# EAGLE design tracker (EAGLE 6.4)

## Sheet 1 of 4
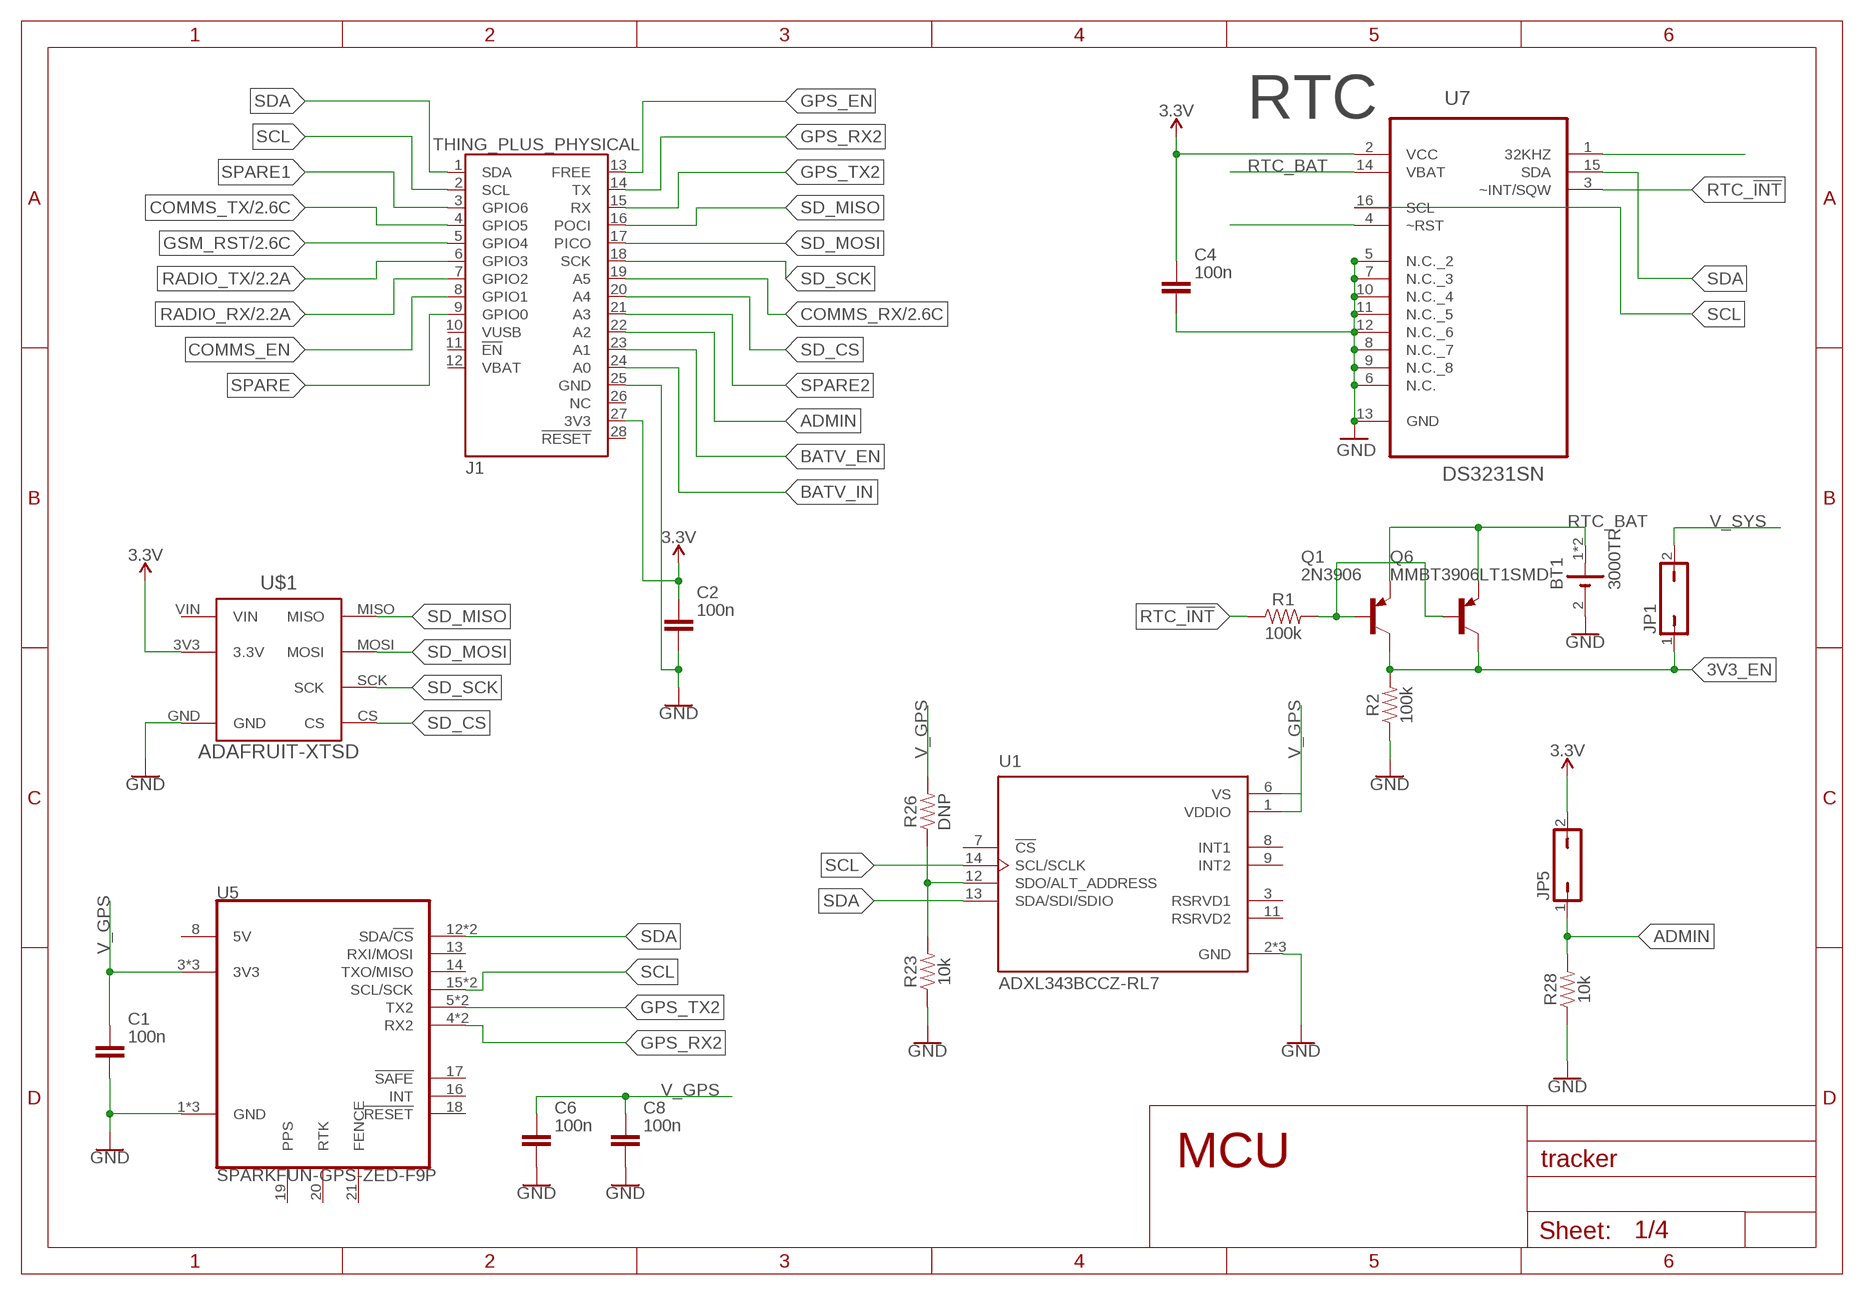
[diagram p0: schematic, sheet 1]

### Parts
BT1  3000TR  [BAT_3000TR]
C1  100n  C_CHIP-0603(1608-METRIC)  [CAPC1608X85]
C2  100n  C_CHIP-0603(1608-METRIC)  [CAPC1608X85]
C4  100n  C_CHIP-0603(1608-METRIC)  [CAPC1608X85]
C6  100n  C_CHIP-0603(1608-METRIC)  [CAPC1608X85]
C8  100n  C_CHIP-0603(1608-METRIC)  [CAPC1608X85]
J1  THING_PLUS_PHYSICAL  [THING_PLUS]
JP1  JP1Q  [JP1]
JP5  JP1Q  [JP1]
Q1  2N3906  [TO92]
Q6  MMBT3906LT1SMD  [SOT23-BEC]
R1  100k  RESISTOR0603  [0603]
R2  100k  RESISTOR0603  [0603]
R23  10k  RESISTOR0603  [0603]
R26  DNP  RESISTOR0603  [0603]
R28  10k  RESISTOR0603  [0603]
U1  ADXL343BCCZ-RL7  [PQFN80P300X500X100-14N]
U5  SPARKFUN-GPS-ZED-F9P  [SPARKFUN-GPS-ZED-F9P]
U7  DS3231SN  [SOIC127P1032X265-16N]
U$1  ADAFRUIT-XTSD  [ADAFRUIT-XTSD]

### Nets
3.3V: C2.1 C4.1 J1.27(3V3) JP5.2 U7.2(VCC) U$1.3V3(3.3V) ; also sheet 2,3,4
3V3_EN: JP1.1 Q1.1(C) Q6.C R2.2 ; also sheet 3
ADMIN: J1.22(A2) JP5.1 R28.2
BATV_EN: J1.23(A1) ; also sheet 4
BATV_IN: J1.24(A0) ; also sheet 4
COMMS_EN: J1.8(GPIO1) ; also sheet 3
COMMS_RX: J1.19(A5) ; also sheet 2
COMMS_TX: J1.4(GPIO5) ; also sheet 2
GND: BT1.2(-) C1.2 C2.2 C4.2 C6.2 C8.2 J1.25(GND) R2.1 R23.1 R28.1 U1.2(GND) U1.4(GND) U1.5(GND) U5.1(GND) U5.7(GND) U5.25(GND) U7.5(N.C._2) U7.6(N.C.) U7.7(N.C._3) U7.8(N.C._7) U7.9(N.C._8) U7.10(N.C._4) U7.11(N.C._5) U7.12(N.C._6) U7.13(GND) U$1.GND ; also sheet 2,3,4
GPS_EN: J1.13(FREE) ; also sheet 3
GPS_RX2: J1.14(TX) U5.4(RX2) U5.11(RX2)
GPS_TX2: J1.15(RX) U5.5(TX2) U5.10(TX2)
GSM_RST: J1.5(GPIO4) ; also sheet 2
N$1: R23.2 R26.1 U1.12(SDO/ALT_ADDRESS)
N$2: Q1.2(B) Q6.B R1.2
N$32: U7.1(32KHZ)
N$52: U7.4(~RST)
RADIO_RX: J1.7(GPIO2) ; also sheet 2
RADIO_TX: J1.6(GPIO3) ; also sheet 2
RTC_!INT: R1.1 U7.3(~INT/SQW)
RTC_BAT: BT1.1(+) BT1.3(+) Q1.3(E) Q6.E U7.14(VBAT)
SCL: J1.2(SCL) U1.14(SCL/SCLK) U5.15(SCL/SCK) U5.22(SCL/SCK) U7.16(SCL)
SD_CS: J1.20(A4) U$1.CS
SD_MISO: J1.16(POCI) U$1.MISO
SD_MOSI: J1.17(PICO) U$1.MOSI
SD_SCK: J1.18(SCK) U$1.SCK
SDA: J1.1(SDA) U1.13(SDA/SDI/SDIO) U5.12(SDA/!CS) U5.23(SDA/!CS) U7.15(SDA)
SPARE: J1.9(GPIO0)
SPARE1: J1.3(GPIO6)
SPARE2: J1.21(A3)
V_GPS: C1.1 C6.1 C8.1 R26.2 U1.1(VDDIO) U1.6(VS) U5.3(3V3) U5.9(3V3) U5.24(3V3) ; also sheet 2,3
V_SYS: JP1.2 ; also sheet 3,4
Unconnected: J1.10(VUSB) J1.11(!EN) J1.12(VBAT) J1.26(NC) J1.28(!RESET) U1.3(RSRVD1) U1.7(!CS) U1.8(INT1) U1.9(INT2) U1.11(RSRVD2) U5.8(5V) U5.13(RXI/MOSI) U5.14(TXO/MISO) U5.16(INT) U5.17(!SAFE) U5.18(!RESET) U5.19(PPS) U5.20(RTK) U5.21(FENCE) U$1.VIN

### Notes on the sheet
- RTC
- MCU

## Sheet 2 of 4
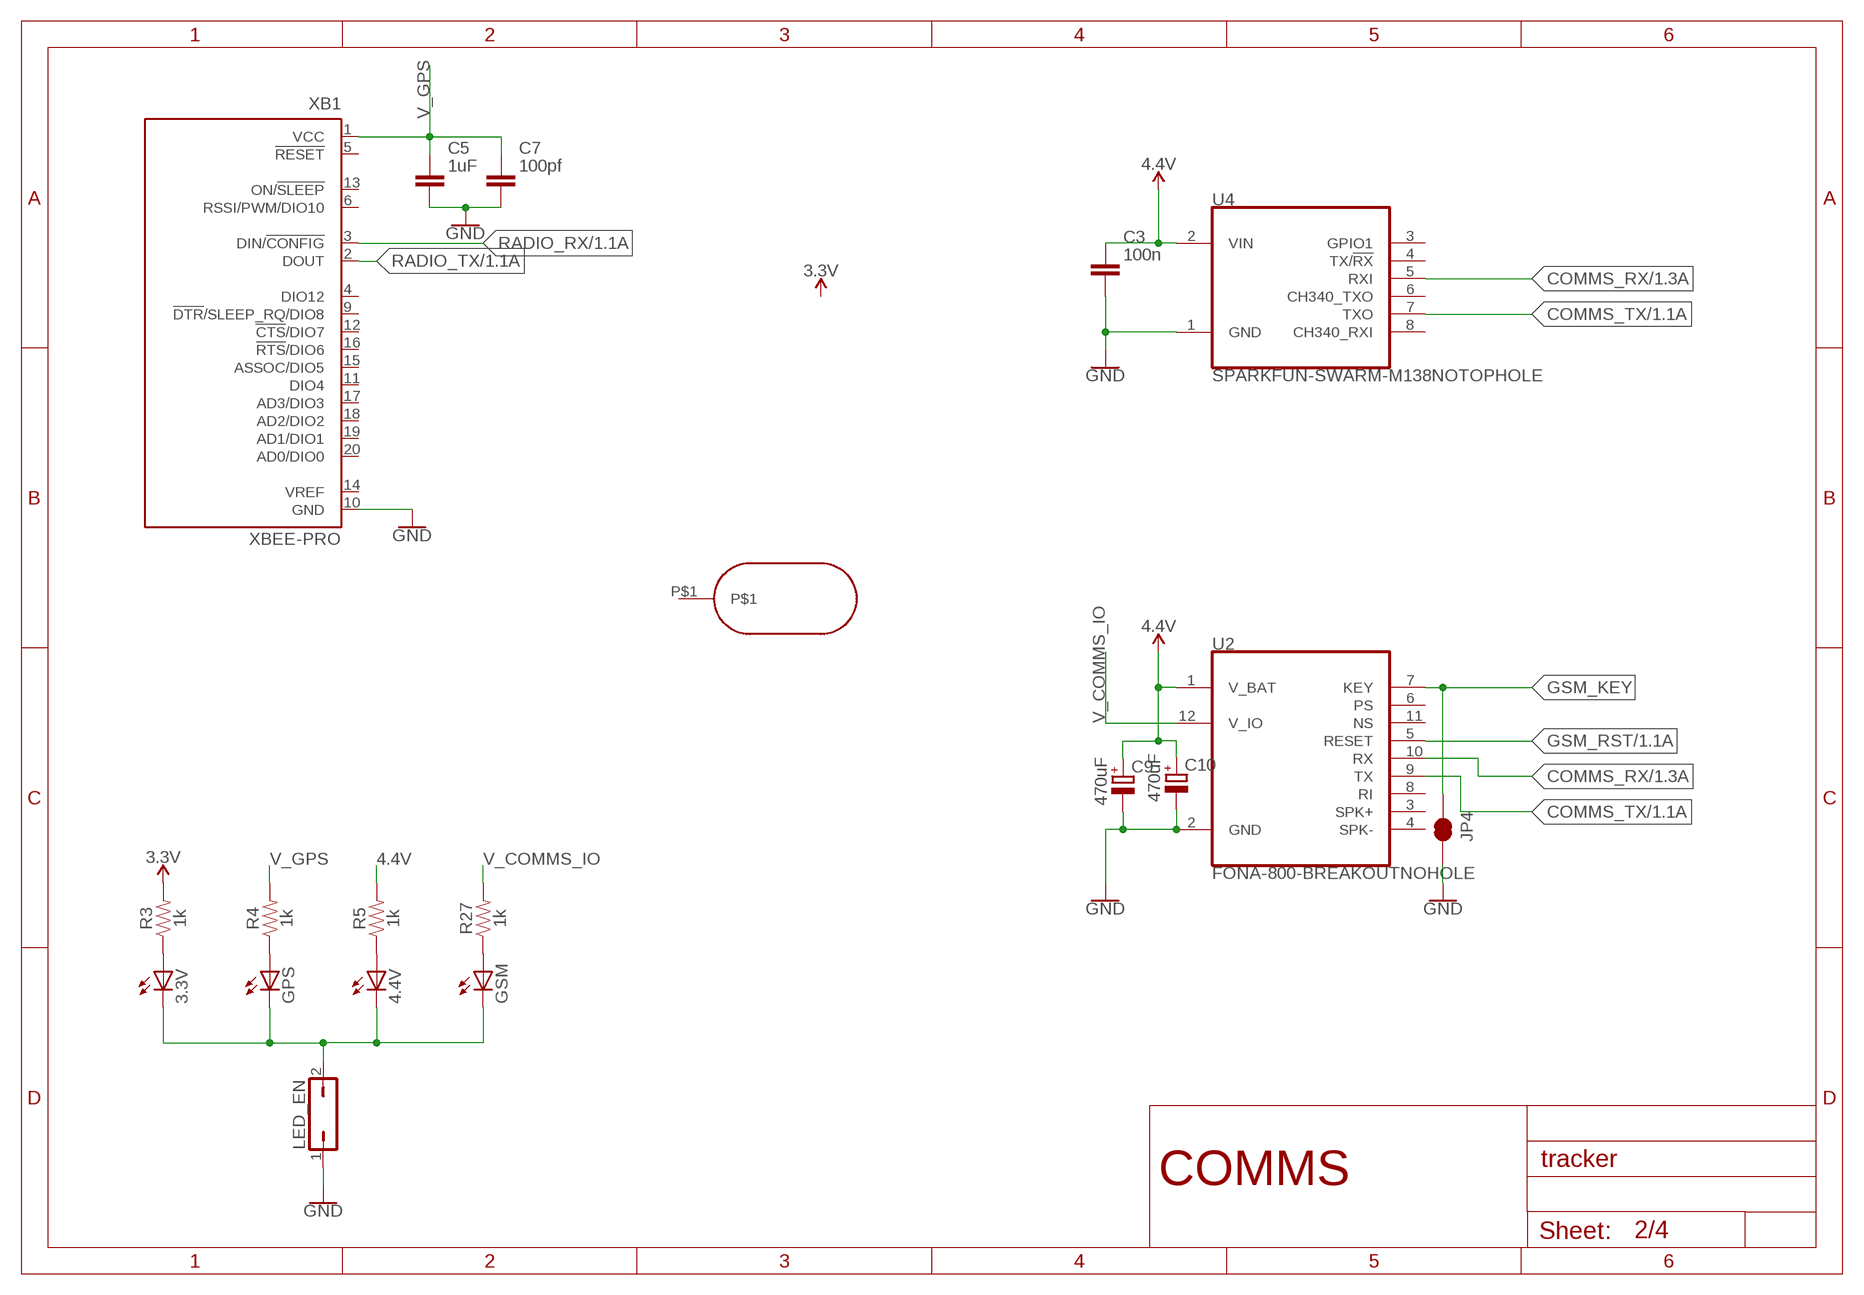
[diagram p1: schematic, sheet 2]

### Parts
3.3V  LEDCHIP-LED0805  [CHIP-LED0805]
4.4V  LEDCHIP-LED0805  [CHIP-LED0805]
C3  100n  C_CHIP-0603(1608-METRIC)  [CAPC1608X85]
C5  1uF  C_CHIP-0603(1608-METRIC)  [CAPC1608X85]
C7  100pf  C_CHIP-0603(1608-METRIC)  [CAPC1608X85]
C9  470uF  C-POL_RADIAL-11MM-DIA  [CAPPRD508W65D1000H1100B]
C10  470uF  C-POL_RADIAL-11MM-DIA  [CAPPRD508W65D1000H1100B]
GPS  LEDCHIP-LED0805  [CHIP-LED0805]
GSM  LEDCHIP-LED0805  [CHIP-LED0805]
JP4  JUMPER-SMT_2_NC_TRACE_SILK  [SMT-JUMPER_2_NC_TRACE_SILK]
LED_EN  JP1Q  [JP1]
R3  1k  RESISTOR0603  [0603]
R4  1k  RESISTOR0603  [0603]
R5  1k  RESISTOR0603  [0603]
R27  1k  RESISTOR0603  [0603]
U2  FONA-800-BREAKOUTNOHOLE  [FONA-800-BREAKOUT-NH]
U4  SPARKFUN-SWARM-M138NOTOPHOLE  [SPARKFUN-SWARM-M138-NTH]
U$2  SLOT130.5  [SLOT130.5]
XB1  XBEE-PRO  [XBEE-PRO]

### Nets
3.3V: R3.2 ; also sheet 1,3,4
4.4V: C3.1 C9.1(+) C10.1(+) R5.2 U2.1(V_BAT) U4.2(VIN) ; also sheet 3,4
COMMS_RX: U2.10(RX) U4.5(RXI) ; also sheet 1
COMMS_TX: U2.9(TX) U4.7(TXO) ; also sheet 1
GND: C3.2 C5.2 C7.2 C9.2(-) C10.2(-) JP4.2 LED_EN.1 U2.2(GND) U4.1(GND) XB1.10(GND) ; also sheet 1,3,4
GSM_KEY: JP4.1 U2.7(KEY)
GSM_RST: U2.5(RESET) ; also sheet 1
N$3: 3.3V.C 4.4V.C GPS.C GSM.C LED_EN.2
N$4: GPS.A R4.1
N$13: 3.3V.A R3.1
N$14: GSM.A R27.1
N$15: 4.4V.A R5.1
RADIO_RX: XB1.3(DIN/!CONFIG) ; also sheet 1
RADIO_TX: XB1.2(DOUT) ; also sheet 1
V_COMMS_IO: R27.2 U2.12(V_IO) ; also sheet 3
V_GPS: C5.1 C7.1 R4.2 XB1.1(VCC) ; also sheet 1,3
Unconnected: U2.3(SPK+) U2.4(SPK-) U2.6(PS) U2.8(RI) U2.11(NS) U4.3(GPIO1) U4.4(TX/!RX) U4.6(CH340_TXO) U4.8(CH340_RXI) U$2.P$1 XB1.4(DIO12) XB1.5(!RESET) XB1.6(RSSI/PWM/DIO10) XB1.9(!DTR!/SLEEP_RQ/DIO8) XB1.11(DIO4) XB1.12(!CTS!/DIO7) XB1.13(ON/!SLEEP) XB1.14(VREF) XB1.15(ASSOC/DIO5) XB1.16(!RTS!/DIO6) XB1.17(AD3/DIO3) XB1.18(AD2/DIO2) XB1.19(AD1/DIO1) XB1.20(AD0/DIO0)

### Notes on the sheet
- COMMS

## Sheet 3 of 4
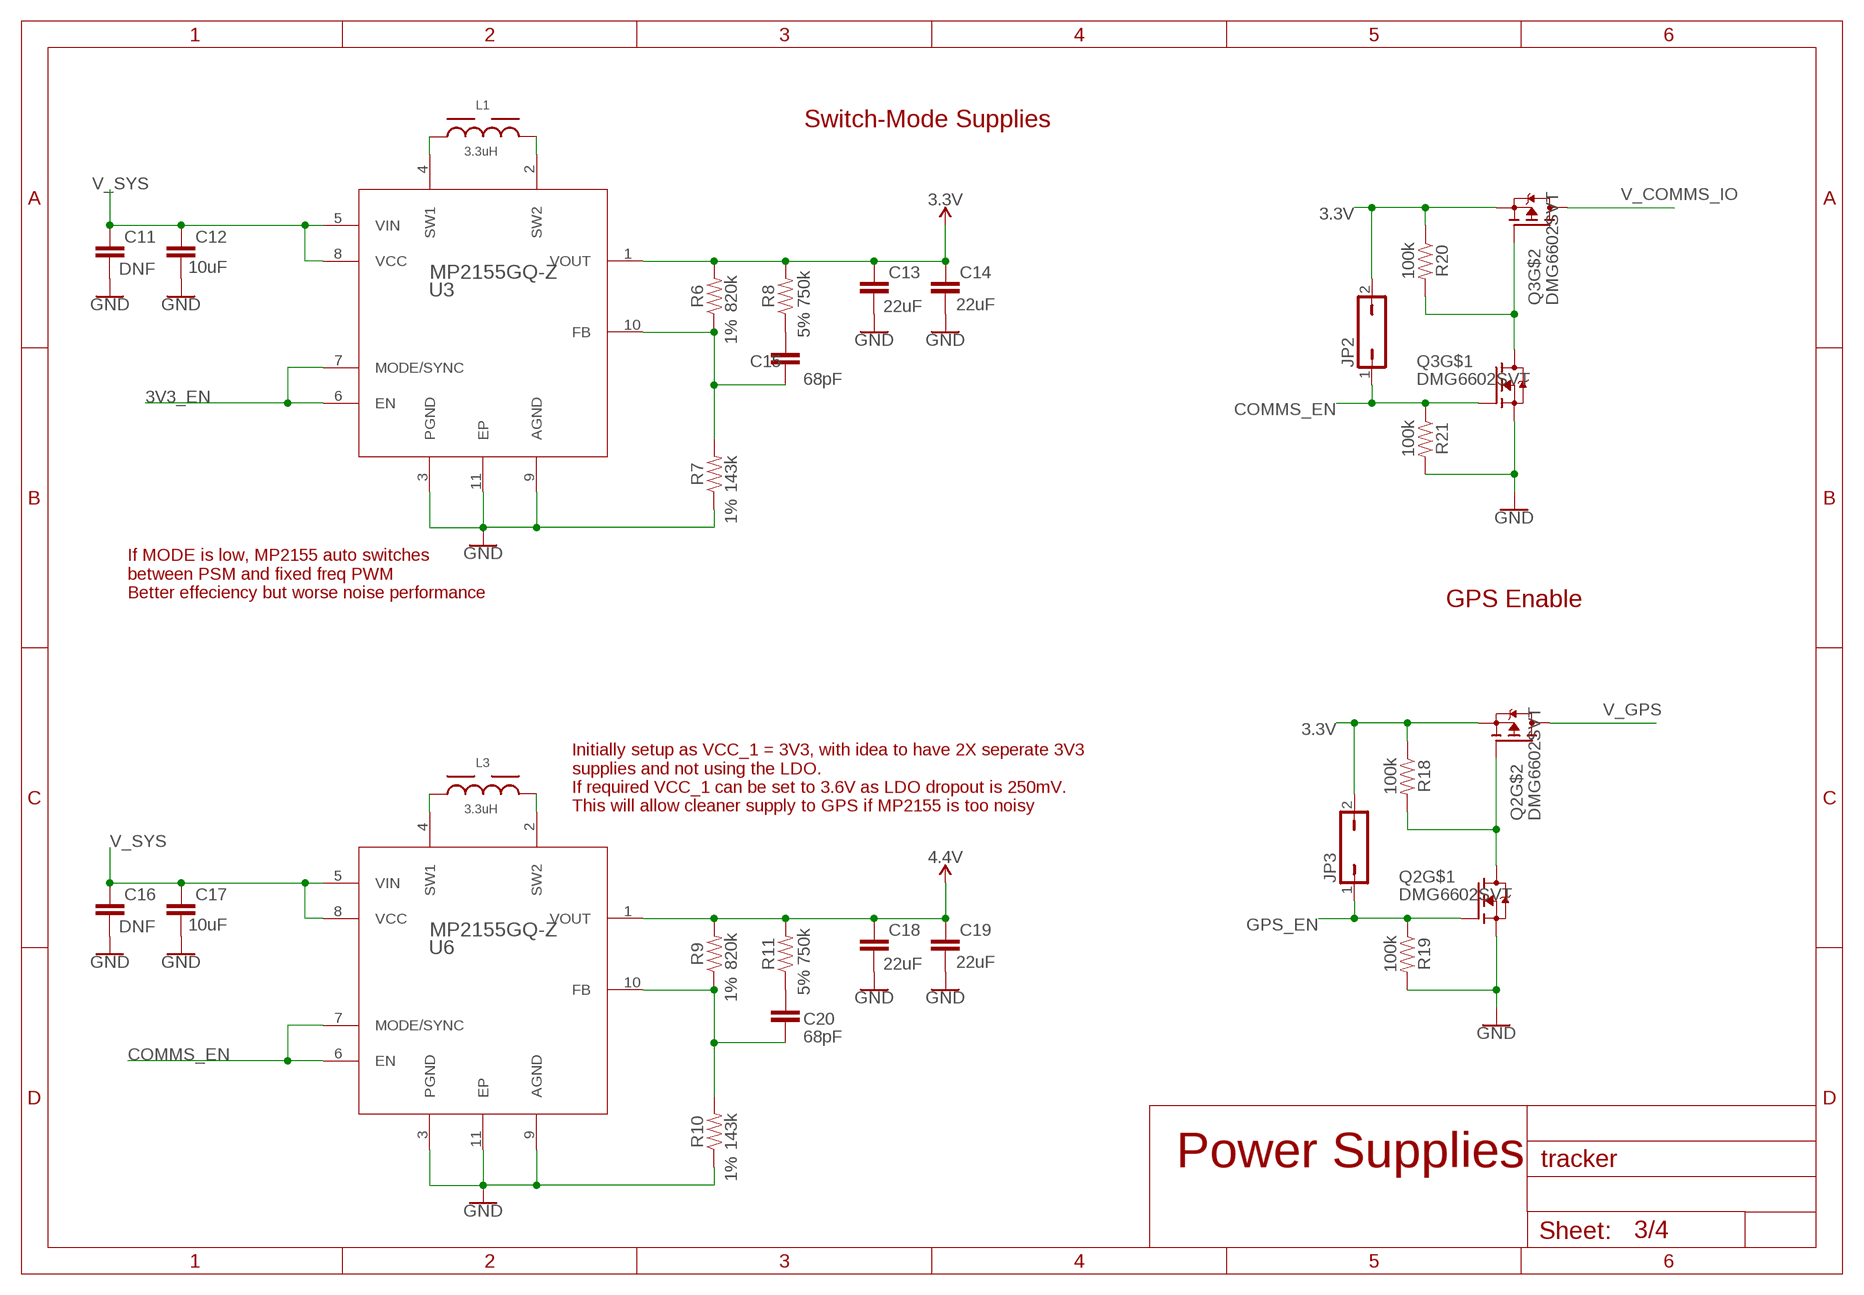
[diagram p2: schematic, sheet 3]

### Parts
C11  DNF  C_CHIP-0805(2012-METRIC)  [CAPC2012X110]
C12  10uF  C_CHIP-0805(2012-METRIC)  [CAPC2012X110]
C13  22uF  C_CHIP-0805(2012-METRIC)  [CAPC2012X110]
C14  22uF  C_CHIP-0805(2012-METRIC)  [CAPC2012X110]
C15  68pF  C_CHIP-0603(1608-METRIC)  [CAPC1608X85]
C16  DNF  C_CHIP-0805(2012-METRIC)  [CAPC2012X110]
C17  10uF  C_CHIP-0805(2012-METRIC)  [CAPC2012X110]
C18  22uF  C_CHIP-0805(2012-METRIC)  [CAPC2012X110]
C19  22uF  C_CHIP-0805(2012-METRIC)  [CAPC2012X110]
C20  68pF  C_CHIP-0603(1608-METRIC)  [CAPC1608X85]
JP2  JP1Q  [JP1]
JP3  JP1Q  [JP1]
L1  3.3uH  WE-HCI_7050_744314330  [WE-HCI_7050]
L3  3.3uH  WE-HCI_7050_744314330  [WE-HCI_7050]
Q2  DMG6602SVT  [TSOT26]
Q3  DMG6602SVT  [TSOT26]
R6  820k  RESISTOR0603  [0603]
R7  143k  RESISTOR0603  [0603]
R8  750k  RESISTOR0603  [0603]
R9  820k  RESISTOR0603  [0603]
R10  143k  RESISTOR0603  [0603]
R11  750k  RESISTOR0603  [0603]
R18  100k  RESISTOR0603  [0603]
R19  100k  RESISTOR0603  [0603]
R20  100k  RESISTOR0603  [0603]
R21  100k  RESISTOR0603  [0603]
U3  MP2155GQ-Z  [QFN-10_MP2155_MNP]
U6  MP2155GQ-Z  [QFN-10_MP2155_MNP]

### Nets
3.3V: C13.1 C14.1 JP2.2 JP3.2 Q2.P$2(S) Q3.P$2(S) R6.2 R8.2 R18.1 R20.1 U3.1(VOUT) ; also sheet 1,2,4
3V3_EN: U3.6(EN) U3.7(MODE/SYNC) ; also sheet 1
4.4V: C18.1 C19.1 R9.2 R11.2 U6.1(VOUT) ; also sheet 2,4
COMMS_EN: JP2.1 Q3.P$1(G) R21.1 U6.6(EN) U6.7(MODE/SYNC) ; also sheet 1
GND: C11.2 C12.2 C13.2 C14.2 C16.2 C17.2 C18.2 C19.2 Q2.P$5(S) Q3.P$5(S) R7.1 R10.1 R19.2 R21.2 U3.3(PGND) U3.9(AGND) U3.11(EP) U6.3(PGND) U6.9(AGND) U6.11(EP) ; also sheet 1,2,4
GPS_EN: JP3.1 Q2.P$1(G) R19.1 ; also sheet 1
N$5: C15.2 R6.1 R7.2 U3.10(FB)
N$9: C15.1 R8.1
N$10: L1.1 U3.4(SW1)
N$11: L1.2 U3.2(SW2)
N$17: C20.2 R9.1 R10.2 U6.10(FB)
N$18: C20.1 R11.1
N$19: L3.1 U6.4(SW1)
N$20: L3.2 U6.2(SW2)
N$34: Q2.P$3(G) Q2.P$6(D) R18.2
N$35: Q3.P$3(G) Q3.P$6(D) R20.2
V_COMMS_IO: Q3.P$4(D) ; also sheet 2
V_GPS: Q2.P$4(D) ; also sheet 1,2
V_SYS: C11.1 C12.1 C16.1 C17.1 U3.5(VIN) U3.8(VCC) U6.5(VIN) U6.8(VCC) ; also sheet 1,4

### Notes on the sheet
- Switch-Mode Supplies
- If MODE is low, MP2155 auto switches 
  between PSM and fixed freq PWM
  Better effeciency but worse noise performance
- GPS Enable
- Initially setup as VCC_1 = 3V3, with idea to have 2X seperate 3V3 
  supplies and not using the LDO.
  If required VCC_1 can be set to 3.6V as LDO dropout is 250mV.
  This will allow cleaner supply to GPS if MP2155 is too noisy
- Power Supplies

## Sheet 4 of 4
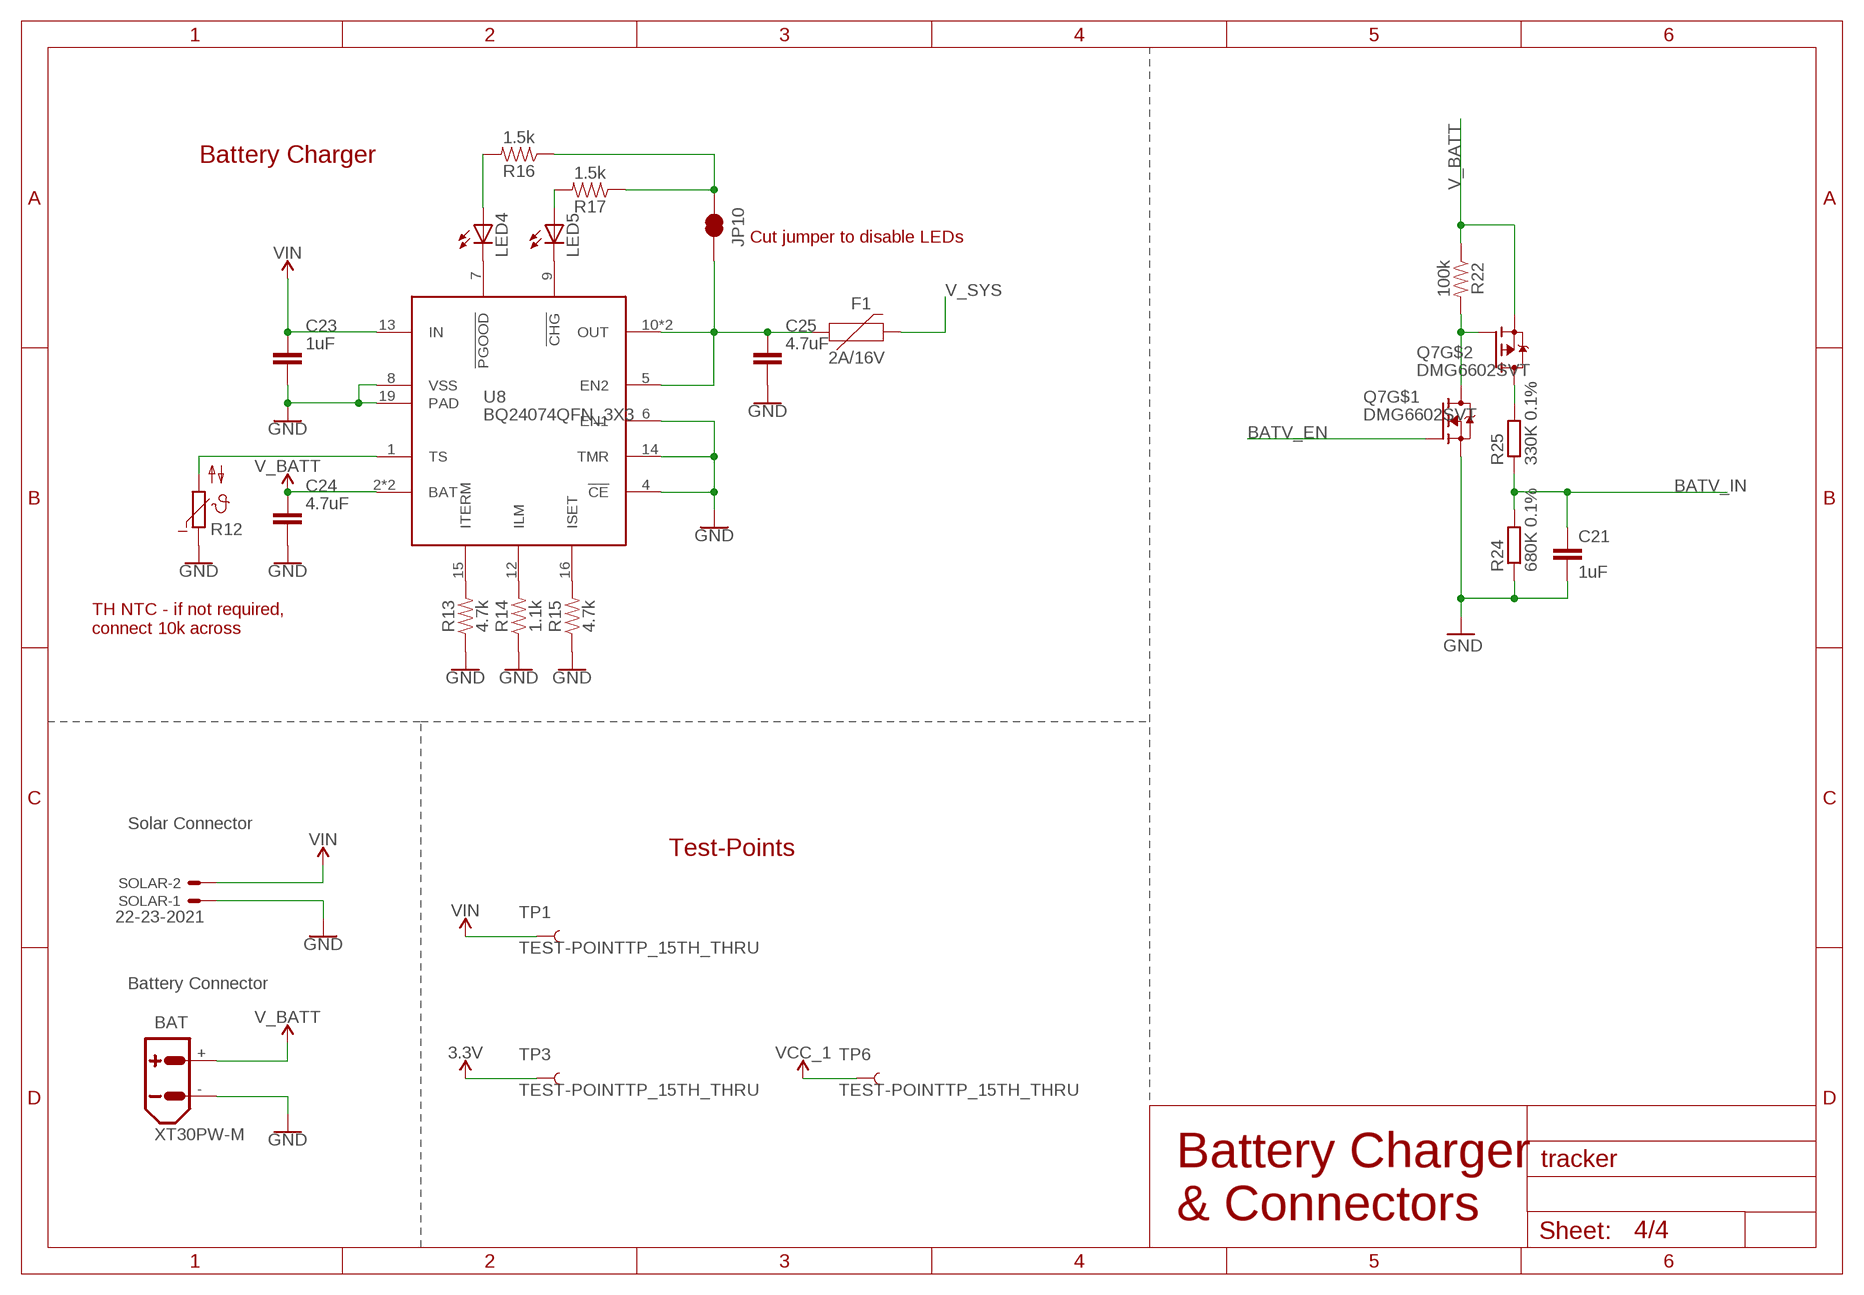
[diagram p3: schematic, sheet 4]

### Parts
BAT  XT30PW-M  [XT30PW-M]
C21  1uF  C-EUC0805  [C0805]
C23  1uF  C_CHIP-0805(2012-METRIC)  [CAPC2012X110]
C24  4.7uF  C_CHIP-0805(2012-METRIC)  [CAPC2012X110]
C25  4.7uF  C_CHIP-0805(2012-METRIC)  [CAPC2012X110]
F1  2A/16V  PPTC_2A  [F1812]
JP10  JUMPER-SMT_2_NC_TRACE_SILK  [SMT-JUMPER_2_NC_TRACE_SILK]
LED4  LEDSML0805  [SML0805]
LED5  LEDSML0805  [SML0805]
Q7  DMG6602SVT  [TSOT26]
R12  DNF  NTC640  [P640]
R13  4.7k  RESISTOR0603  [0603]
R14  1.1k  RESISTOR0603  [0603]
R15  4.7k  RESISTOR0603  [0603]
R16  1.5k  RESISTOR0603  [0603]
R17  1.5k  RESISTOR0603  [0603]
R22  100k  RESISTOR0603  [0603]
R24  680K 0.1%  R-EU_R0805  [R0805]
R25  330K 0.1%  R-EU_R0805  [R0805]
SOLAR  22-23-2021  [22-23-2021]
TP1  TEST-POINTTP_15TH_THRU  [TP_15TH]
TP3  TEST-POINTTP_15TH_THRU  [TP_15TH]
TP6  TEST-POINTTP_15TH_THRU  [TP_15TH]
U8  BQ24074QFN_3X3  [QFN_3X3]

### Nets
3.3V: TP3.P$1 ; also sheet 1,2,3
4.4V: TP6.P$1 ; supply symbol labelled VCC_1 ; also sheet 2,3
BATV_EN: Q7.P$1(G) ; also sheet 1
BATV_IN: C21.1 R24.2 R25.1 ; also sheet 1
GND: BAT.- C21.2 C23.2 C24.2 C25.2 Q7.P$5(S) R12.1 R13.1 R14.1 R15.1 R24.1 SOLAR.1 U8.4(!CE) U8.6(EN1) U8.8(VSS) U8.14(TMR) U8.19(PAD) ; also sheet 1,2,3
N$12: Q7.P$3(G) Q7.P$6(D) R22.2
N$21: R12.2 U8.1(TS)
N$22: R13.2 U8.15(ITERM)
N$23: R14.2 U8.12(ILM)
N$24: R15.2 U8.16(ISET)
N$25: LED4.C U8.7(!PGOOD)
N$27: LED5.C U8.9(!CHG)
N$28: JP10.1 R16.1 R17.1
N$29: LED4.A R16.2
N$30: LED5.A R17.2
N$31: C25.1 F1.1 JP10.2 U8.5(EN2) U8.10(OUT) U8.11(OUT)
V_BATT: BAT.+ C24.1 Q7.P$2(S) R22.1 U8.2(BAT) U8.3(BAT)
V_SYS: F1.2 ; also sheet 1,3
VCC_HP2_SW1: Q7.P$4(D) R25.2
VIN: C23.1 SOLAR.2 TP1.P$1 U8.13(IN)

### Notes on the sheet
- Battery Charger
- Cut jumper to disable LEDs
- TH NTC - if not required, 
  connect 10k across
- Solar Connector
- Test-Points
- Battery Connector
- Battery Charger 
  & Connectors

## Library data of the parts
3.3V 4.4V GPS GSM LED4 LED5 = led:LED: LED OSRAM: - CHIPLED LG R971, LG N971, LY N971, LG Q971, LY Q971, LO R971, LY R971 LH N974, LH R974 LS Q976, LO Q976, LY Q976 LO Q996 - Hyper CHIPLED LW Q18S LB Q993, LB Q99A, LB R99A - SideLED LS A670, LO A670, LY A670, LG A670, LP A670 LB A673, LV A673, LT A673, LW A673 LH A674 LY A675 LS A676, LA A676, LO A676, LY A676, LW A676 LS A679, LY A679, LG A679 - Hyper Micro SIDELED® LS Y876, LA Y876, LO Y876, LY Y876 LT Y87S - SmartLED LW L88C, LW L88S LB L89C, LB L89S, LG L890 LS L89K, LO L89K, LY L89K LS L896, LA L896, LO L896, LY L896 - TOPLED LS T670, LO T670, LY T670, LG T670, LP T670 LSG T670, LSP T670, LSY T670, LOP T670, LYG T670 LG T671, LOG T671, LSG T671 LB T673, LV T673, LT T673, LW T673 LH T674 LS T676, LA T676, LO T676, LY T676, LB T676, LH T676, LSB T676, LW T676 LB T67C, LV T67C, LT T67C, LS T67K, LO T67K, LY T67K, LW E67C LS E67B, LA E67B, LO E67B, LY E67B, LB E67C, LV E67C, LT E67C LW T67C LS T679, LY T679, LG T679 LS T770, LO T770, LY T770, LG T770, LP T770 LB T773, LV T773, LT T773, LW T773 LH T774 LS E675, LA E675, LY E675, LS T675 LS T776, LA T776, LO T776, LY T776, LB T776 LHGB T686 LT T68C, LB T68C - Hyper Mini TOPLED® LB M676 - Mini TOPLED Santana® LG M470 LS M47K, LO M47K, LY M47K Source: http://www.osram.convergy.de LUXEON: - LUMILED® LXK2-PW12-R00, LXK2-PW12-S00, LXK2-PW14-U00, LXK2-PW14-V00 LXK2-PM12-R00, LXK2-PM12-S00, LXK2-PM14-U00 LXK2-PE12-Q00, LXK2-PE12-R00, LXK2-PE12-S00, LXK2-PE14-T00, LXK2-PE14-U00 LXK2-PB12-K00, LXK2-PB12-L00, LXK2-PB12-M00, LXK2-PB14-N00, LXK2-PB14-P00, LXK2-PB14-Q00 LXK2-PR12-L00, LXK2-PR12-M00, LXK2-PR14-Q00, LXK2-PR14-R00 LXK2-PD12-Q00, LXK2-PD12-R00, LXK2-PD12-S00 LXK2-PH12-R00, LXK2-PH12-S00 LXK2-PL12-P00, LXK2-PL12-Q00, LXK2-PL12-R00 Source: www.luxeon.com KINGBRIGHT: KA-3528ASYC Source: www.kingbright.com
BAT = amass:XT30: AMASS XT30 connector Store in Japan AMASS XT30 connector <https://szc.jp/ams-xt30>
BT1 = 3000TR:3000TR: Ultra Low Profile SMT Coin Cell Battery Contact Retainer for 12 mm Cell Check availability <https://pricing.snapeda.com/parts/3000TR/Keystone/view-part?ref=eda>; AVAILABILITY: In Stock; DESCRIPTION: SMT Holder for 12mm Cell-Tin Nickel Plate on T&R; MF: Keystone; MP: 3000TR; PACKAGE: None; PRICE: None; PURCHASE-URL: https://pricing.snapeda.com/search/part/3000TR/?ref=eda
C1-C8 C11 C16 C23-C25 = Capacitor:C: Capacitor - Generic; CATEGORY: Capacitor
C9 C10 = Capacitor:C-POL: Capacitor Polarised - Generic; CATEGORY: Capacitor
C12 C17 = Capacitor:C: Capacitor - Generic; CATEGORY: Capacitor; TYPE: X7R; VOLTAGE_RATING: 6.3V
C13 C14 C18 C19 = Capacitor:C: Capacitor - Generic; CATEGORY: Capacitor; TYPE: X5R; VOLTAGE_RATING: 10V
C15 C20 = Capacitor:C: Capacitor - Generic; CATEGORY: Capacitor; TYPE: X7R; VOLTAGE_RATING: 50V
C21 = resistor:C-EU: CAPACITOR, European symbol
F1 = GlacTracker:PPTC_2A
J1 = SparkFun-Boards:THING_PLUS_PHYSICAL
JP1-JP3 JP5 LED_EN = jumper:JP1Q: JUMPER
JP4 JP10 = SparkFun-Jumpers:JUMPER-SMT_2_NC_TRACE: Normally closed trace jumper This jumper has a trace between two pads so it's normally closed (NC). Use a razor knife to open the connection. For best results follow the IPC guidelines for cutting traces: Cutout at least 0.063 mm (0.005 in). Remove all loose material to clean up the cut area. Seal the cut with an approved epoxy. Reapply solder to reclose the connection.
L1 L3 = Eagle_WE-HCI (rev19a):WE-HCI_7050: WE-HCI SMD Flat Wire High Current Inductor Shielded Characteristics AECQ 200 qualified Magnetically shielded Flat wire coil for low losses at high frequency Low stray field Operating temperature: –40 °C to +125°C / +150 °C / +155°C Recommended solder profile: Reflow Applications Graphic cards Laptops Industrial computers Motherboards High current switching regulators DC/DC converter Polyphase-switching regulators Filter <https://katalog.we-online.de/media/images/v2/o14796v209%20Family_WE-HCI.jpg> Details see: https://katalog.we-online.de/en/pbs/WE-HCI#vs_ct:13 Updated by Yingchun, Shan 2019-08-06 2019 (C) Wurth Elektronik; DATASHEET-URL: https://katalog.we-online.com/pbs/datasheet/744314330.pdf; FRES: 65MHz; IR: 9A; ISAT: 8A; LR: 2.2uH; MATERIAL: Superflux; PART-NUMBER: 744314330; RDC: 9mOhm
Q1 = transistor-pnp:2N3906: PNP Transistor
Q2 Q3 Q7 = farnell-parts:DMG6602SVT
Q6 = transistor-pnp:MMBT3906*: PNP Transistror
R1-R5 R13-R23 R26-R28 = SparkFun-Resistors:RESISTOR: Generic Resistor Package
R6 R7 R9 R10 = SparkFun-Resistors:RESISTOR: Generic Resistor Package; TOLERANCE: 1%
R8 R11 = SparkFun-Resistors:RESISTOR: Generic Resistor Package; TOLERANCE: 5%
R12 = ptc-ntc:NTC640: PHILIPS NTC; OC_FARNELL: unknown; OC_NEWARK: unknown
R24 R25 = resistor:R-EU_: RESISTOR, European symbol
SOLAR = con-molex:22-23-2021: .100" (2.54mm) Center Header - 2 Pin; MF: MOLEX; MPN: 22-23-2021; OC_FARNELL: 1462926; OC_NEWARK: 25C3832
TP1 TP3 TP6 = SparkFun-Connectors:TEST-POINT: SparkFun Test Points Bare copper test points for troubleshooting or In-Circuit-Testing. These are used by our Production team for verifying production board runs using pogo-pins on test beds. SparkFun Products: SparkFun LSM9DS1 Breakout <https://www.sparkfun.com/products/13284> SparkFun PSOC <https://www.sparkfun.com/products/13714> SparkFun Load Cell Amplifier <https://www.sparkfun.com/products/13879>
U1 = GlacTracker:ADXL343BCCZ-RL7
U2 = GlacTracker:FONA-800-BREAKOUT
U3 U6 = GlacTracker:MP2155GQ-Z; COPYRIGHT: Copyright (C) 2022 Ultra Librarian. All rights reserved.; MANUFACTURER_PART_NUMBER: MP2155GQ-Z; MFR_NAME: Monolithic Power Systems
U4 = GlacTracker:SPARKFUN-SWARM-M138
U5 = GlacTracker:SPARKFUN-GPS-ZED-F9P
U7 = farnell-parts:DS3231SN: Extremely Accurate I2C-Integrated RTC/TCXO/Crystal; MPN: DS3231SN#; OC_FARNELL: 1593292; OC_NEWARK: 68K3406; PACKAGE: SOIC-16; SUPPLIER: Maxim
U8 = GlacTracker:BQ24074
U$1 = GlacTracker:ADAFRUIT-XTSD
U$2 = GlacTracker:SLOT130.5
XB1 = xbee:XBEE: XBee (TM) /XBee-PRO(TM) OEM RF Modules Source: MaxStream, Inc. xbee_productmanual.pdf; MPN: XBP24-AWI-001; OC_FARNELL: 1337916; OC_NEWARK: 42M2667

## Board
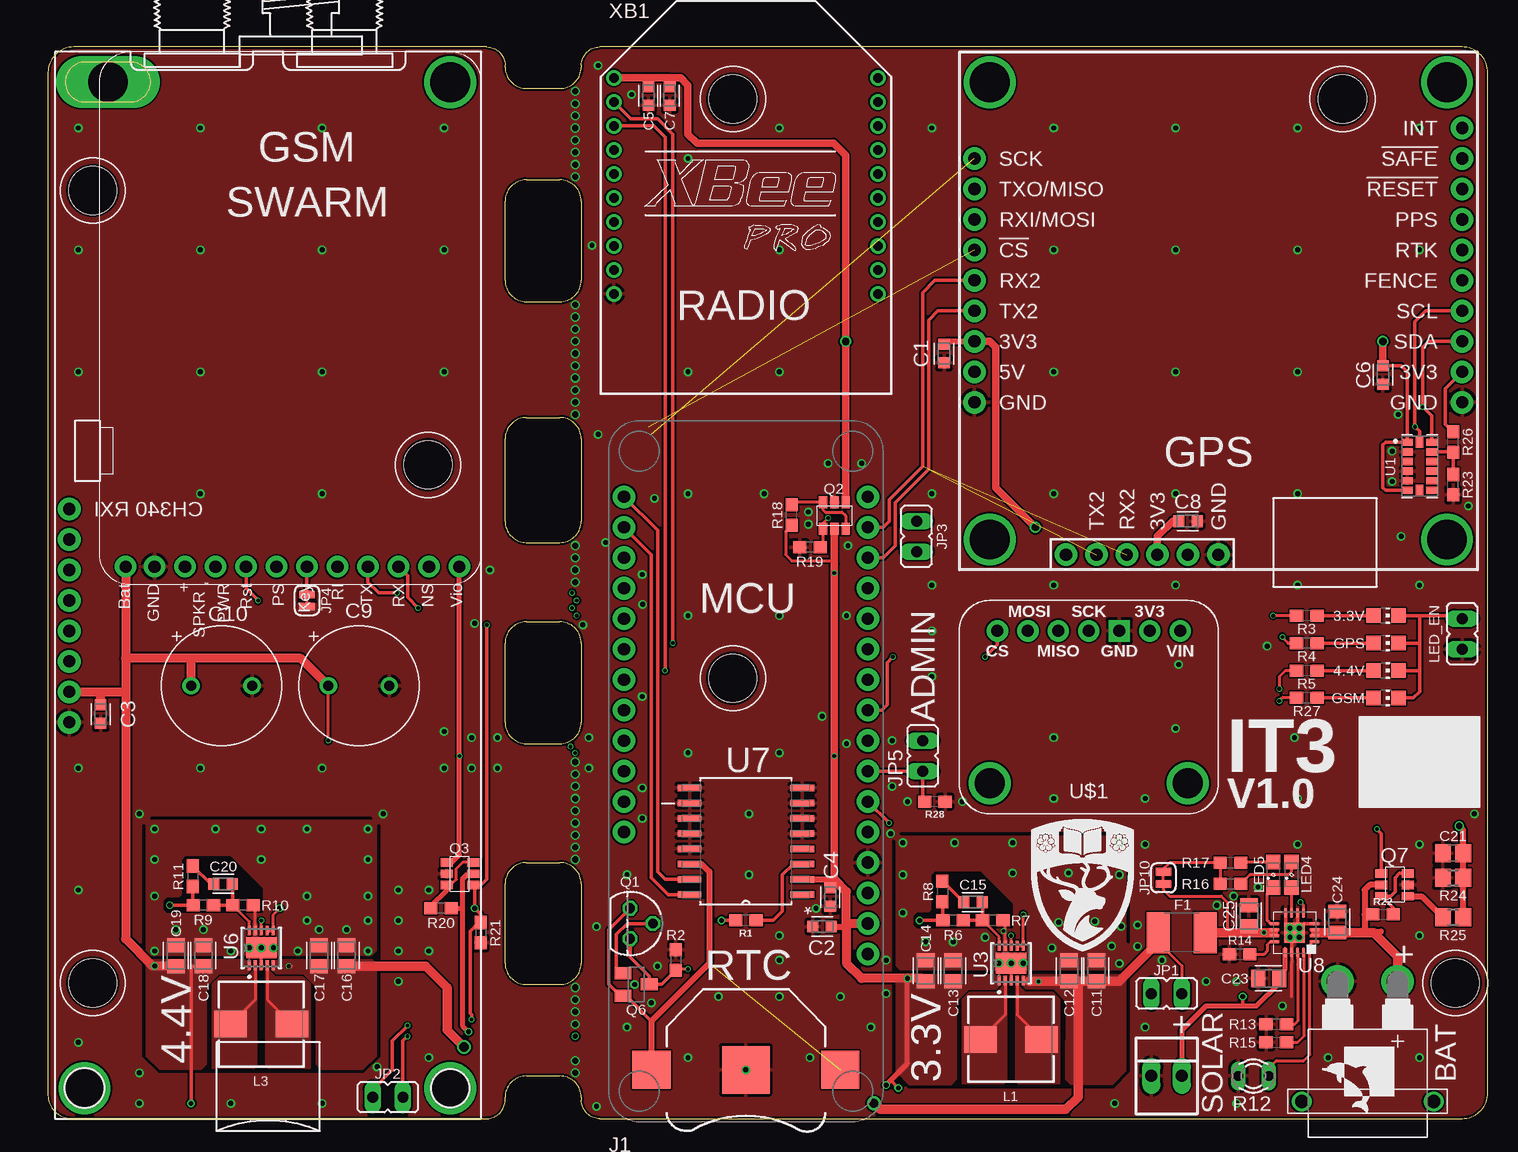
[diagram p4: board, top side]
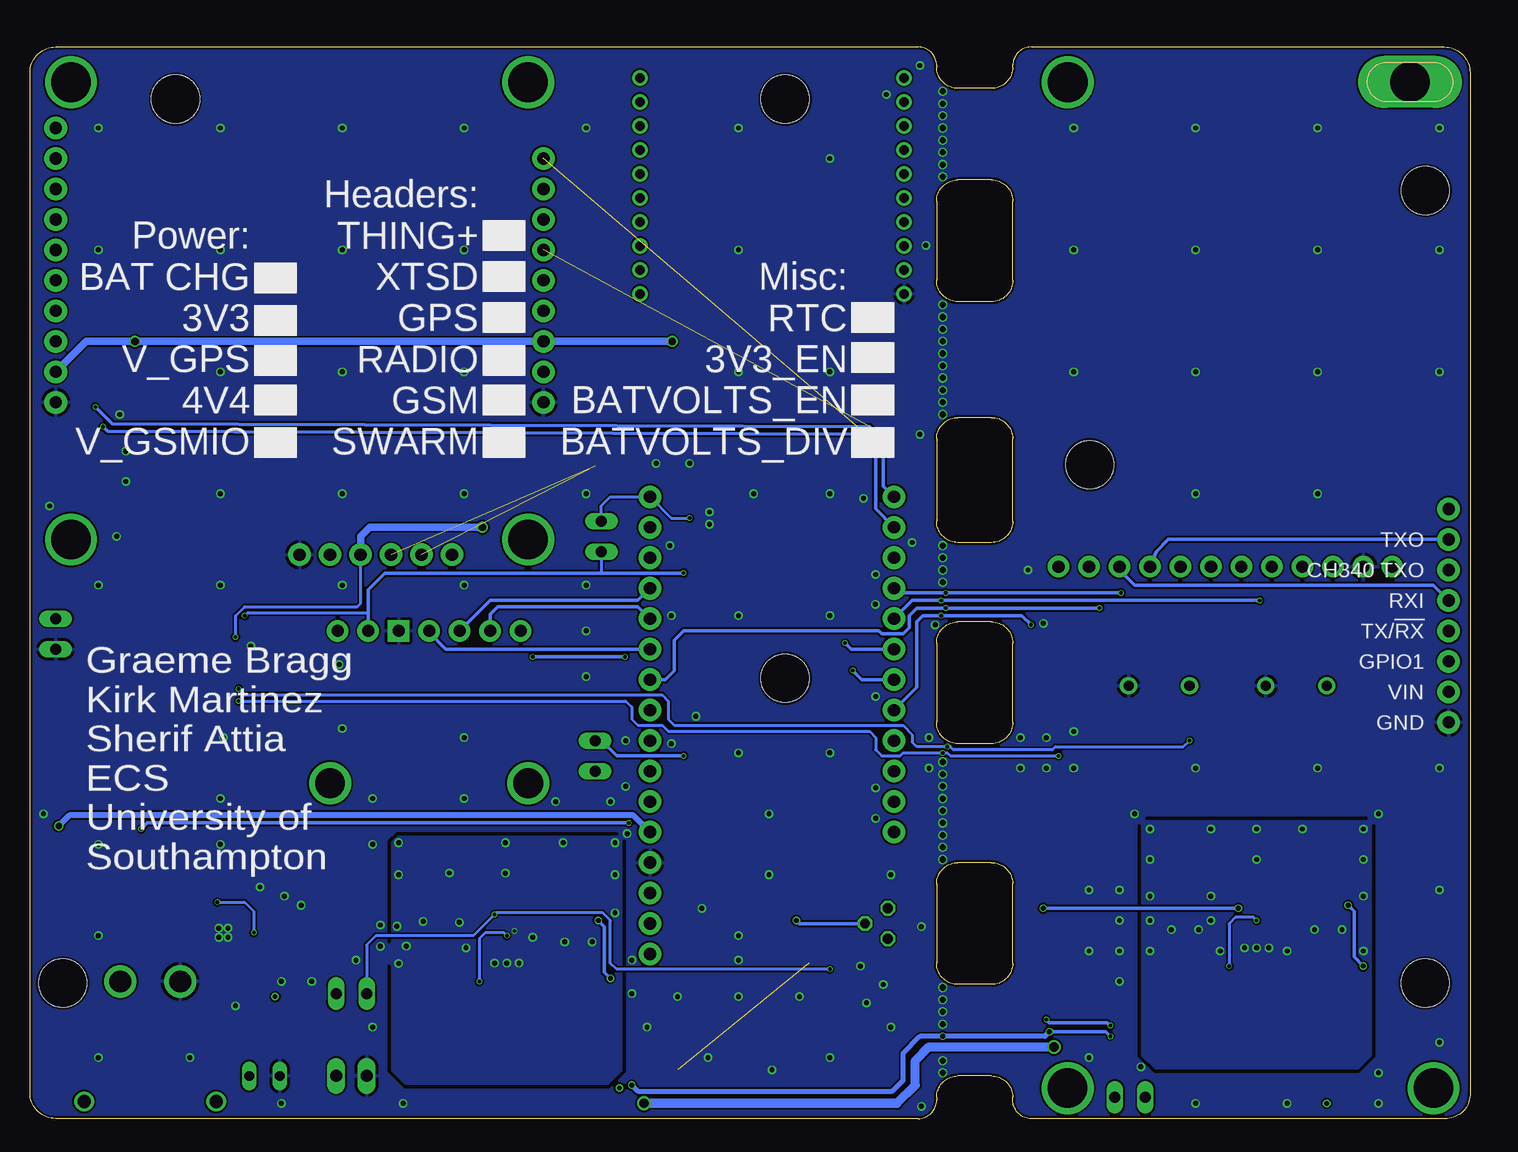
[diagram p5: board, bottom side, seen from below]

Size 120 x 89.3 mm. Coordinates in mm from the lower left corner, seen from the top.
Outline: 0,87.15 0,2.15 arc90 1.9,0 36.58,0 arc90 38.1,1.52 38.1,1.78 arc-90 39.88,3.56 42.68,3.56 arc-90 44.45,1.78 44.45,1.52 arc90 45.98,0 117.85,0 arc90 120,2.15 120,87.15 arc90 117.85,89.3 45.98,89.3 arc90 44.45,87.78 44.45,87.63 arc-90 42.68,85.85 39.88,85.85 arc-90 38.1,87.63 38.1,87.78 arc90 36.58,89.3 2.15,89.3 arc90 0,87.15
Outline: 44.45,76.45 44.45,69.85 arc-90 42.68,68.07 39.88,68.07 arc-90 38.1,69.85 38.1,76.45 arc-90 39.88,78.23 42.68,78.23 arc-90 44.45,76.45
Outline: 44.45,56.64 44.45,49.78 arc-90 42.68,48.01 39.88,48.01 arc-90 38.1,49.78 38.1,56.64 arc-90 39.88,58.42 42.68,58.42 arc-90 44.45,56.64
Outline: 44.45,39.62 44.45,33.02 arc-90 42.68,31.24 39.88,31.24 arc-90 38.1,33.02 38.1,39.62 arc-90 39.88,41.4 42.68,41.4 arc-90 44.45,39.62
Outline: 44.45,19.56 44.45,12.95 arc-90 42.68,11.18 39.88,11.18 arc-90 38.1,12.95 38.1,19.56 arc-90 39.88,21.34 42.68,21.34 arc-90 44.45,19.56
Copper layers (1*16): Top 0.035559375mm / dielectric 1.6mm / Bottom 0.035559375mm
Design rules "jlcpcb2layer": minimum track width 5mil, minimum drill 12mil, track to track 5mil, track to pad 5mil, pad to pad 5mil, via to via 5mil, smd to smd 5mil, copper to edge 8mil, drill to drill 6mil, minimum pad ring 5mil, minimum via ring 3mil, stop-mask expansion 2.5mil, vias tented up to drill 0mil, thermal gap 10mil
Holes 4 mm at 117.28,11.3 3.74,11.3 3.74,77.34 107.88,84.96 57.08,84.96 57.08,36.7 31.68,54.48
tRestrict: area 17.5,4.1 to 18,12.2; area 80.1,2.8 to 80.4,10.9; 21 lines
bRestrict: 14 lines

### Footprints (pad centres in the part's own frame; a part is rotated, then mirrored left to right if it is on the bottom)
CHIP-LED0805 = smd 1.2 x 1.2: A 0,-1.05; C 0,1.05
XT30PW-M = drill 1.8: + -2.5,0; - 2.5,0 | drill 1.1: P$3 -5.5,10; P$4 5.5,10
BAT_3000TR = smd 3.18 x 3.18: 1 -7.87,0; 3 7.87,0 | smd 3.96 x 3.96: 2 0,0
CAPC1608X85 = smd 0.921 x 0.97: 1 -0.775,0; 2 0.775,0
CAPPRD508W65D1000H1100B = drill 0.85 pad 1.45: 1 -2.54,0; 2 2.54,0
CAPC2012X110 = smd 1.165 x 1.465: 1 -0.875,0; 2 0.875,0
C0805 = smd 1.3 x 1.5: 1 -0.85,0; 2 0.85,0
F1812 = smd 1.9 x 3.4: 1 -1.95,0; 2 1.95,0
THING_PLUS = drill 1.016 pad 1.88: 1 1.27,52.07; 2 1.27,49.53; 3 1.27,46.99; 4 1.27,44.45; 5 1.27,41.91; 6 1.27,39.37; 7 1.27,36.83; 8 1.27,34.29; 9 1.27,31.75; 10 1.27,29.21; 11 1.27,26.67; 12 1.27,24.13; 13 21.59,52.07; 14 21.59,49.53; 15 21.59,46.99; 16 21.59,44.45; 17 21.59,41.91; 18 21.59,39.37; 19 21.59,36.83; 20 21.59,34.29; 21 21.59,31.75; 22 21.59,29.21; 23 21.59,26.67; 24 21.59,24.13; 25 21.59,21.59; 26 21.59,19.05; 27 21.59,16.51; 28 21.59,13.97
JP1 = drill 0.914 long: 1 0,-1.27; 2 0,1.27
SMT-JUMPER_2_NC_TRACE_SILK = smd 0.635 x 1.27: 1 -0.508,0; 2 0.508,0
WE-HCI_7050 = smd 2.7 x 2.2: 1 -2.55,0; 2 2.55,0
SML0805 = smd 1.2 x 1.2: A 1.05,0; C -1.05,0
TO92 = drill 0.813 octagon: 1 1.27,0; 2 0,1.905; 3 -1.27,0
TSOT26 = smd 0.7 x 1: P$1 0.4,-1.9; P$2 1.35,-1.9; P$3 2.3,-1.9; P$4 2.3,0.3; P$5 1.35,0.3; P$6 0.4,0.3
SOT23-BEC = smd 1 x 1.4: B -0.95,-1.1; C 0,1.1; E 0.95,-1.1
0603 = smd 1.1 x 1: 1 -0.85,0; 2 0.85,0
P640 = drill 0.813 long: 1 -1.27,0; 2 1.27,0
R0805 = smd 1.3 x 1.5: 1 -0.85,0; 2 0.85,0
22-23-2021 = drill 1 long: 1 -1.27,0; 2 1.27,0
TP_15TH = drill 0.381 pad 0.61: P$1 0,0
PQFN80P300X500X100-14N = smd 0.92 x 0.61: 1 -1.01,2; 2 -1.01,1.2; 3 -1.01,0.4; 4 -1.01,-0.4; 5 -1.01,-1.2; 6 -1.01,-2; 8 1.01,-2; 9 1.01,-1.2; 10 1.01,-0.4; 11 1.01,0.4; 12 1.01,1.2; 13 1.01,2 | smd 0.61 x 0.92: 7 0,-2.01; 14 0,2.01
FONA-800-BREAKOUT-NH = drill 1.016 pad 1.778: 1 2.159,1.524; 2 4.572,1.524; 3 7.112,1.524; 4 9.652,1.524; 5 12.192,1.524; 6 14.732,1.524; 7 17.272,1.524; 8 19.812,1.524; 9 22.352,1.524; 10 24.892,1.524; 11 27.432,1.524; 12 29.972,1.524
QFN-10_MP2155_MNP = smd 0.813 x 0.254: 1 -1.448,1; 2 -1.448,0.5; 3 -1.448,0; 4 -1.448,-0.5; 5 -1.448,-1; 6 1.448,-1; 7 1.448,-0.5; 8 1.448,0; 9 1.448,0.5; 10 1.448,1 | smd 1.753 x 2.54: 11 0,0
SPARKFUN-SWARM-M138-NTH = drill 1.016 pad 1.88: 1 1.27,33.02; 2 1.27,35.56; 3 1.27,38.1; 4 1.27,40.64; 5 1.27,43.18; 6 1.27,45.72; 7 1.27,48.26; 8 1.27,50.8 | drill 3.302: 11 2.54,2.54; 12 33.02,2.54
SPARKFUN-GPS-ZED-F9P = drill 1.016 pad 1.88: 1 1.27,21.59; 2 1.27,24.13; 3 1.27,26.67; 4 1.27,29.21; 5 1.27,31.75; 6 1.27,34.29; 7 13.97,41.91; 8 16.51,41.91; 9 19.05,41.91; 10 21.59,41.91; 11 24.13,41.91; 12 26.67,41.91; 13 29.21,41.91; 14 31.75,41.91; 15 34.29,41.91; 16 36.83,1.27; 17 34.29,1.27; 18 31.75,1.27; 19 29.21,1.27; 20 26.67,1.27; 21 24.13,1.27; 22 21.59,1.27; 23 19.05,1.27; 24 16.51,1.27; 25 13.97,1.27 | drill 3.302: P$1 2.54,40.64; P$2 40.64,40.64; P$3 40.64,2.54; P$4 2.54,2.54
SOIC127P1032X265-16N = smd 1.981 x 0.533: 1 -4.699,4.445; 2 -4.699,3.175; 3 -4.699,1.905; 4 -4.699,0.635; 5 -4.699,-0.635; 6 -4.699,-1.905; 7 -4.699,-3.175; 8 -4.699,-4.445; 9 4.699,-4.445; 10 4.699,-3.175; 11 4.699,-1.905; 12 4.699,-0.635; 13 4.699,0.635; 14 4.699,1.905; 15 4.699,3.175; 16 4.699,4.445
QFN_3X3 = smd 0.85 x 0.3: 1 -1.655,0.75; 2 -1.655,0.25; 3 -1.655,-0.25; 4 -1.655,-0.75; 9 1.655,-0.75; 10 1.655,-0.25; 11 1.655,0.25; 12 1.655,0.75 | smd 0.3 x 0.85: 5 -0.75,-1.655; 6 -0.25,-1.655; 7 0.25,-1.655; 8 0.75,-1.655; 13 0.75,1.655; 14 0.25,1.655; 15 -0.25,1.655; 16 -0.75,1.655 | smd 1.68 x 1.68: 19 0,0
ADAFRUIT-XTSD = drill 1.003 pad 1.778: 3V3 5.715,2.54; CS 18.415,2.54; MISO 13.335,2.54; MOSI 15.875,2.54; SCK 10.795,2.54; VIN 3.175,2.54 | drill 1.003 pad 1.778 square: GND 8.255,2.54 | drill 2.489: P$8 2.54,15.24; P$9 19.05,15.24
SLOT130.5 = drill 3.315 long: P$1 0,0
XBEE-PRO = drill 0.8 pad 1.27: 1 -11,9; 2 -11,7; 3 -11,5; 4 -11,3; 5 -11,1; 6 -11,-1; 7 -11,-3; 8 -11,-5; 9 -11,-7; 10 -11,-9; 11 11,-9; 12 11,-7; 13 11,-5; 14 11,-3; 15 11,-1; 16 11,1; 17 11,3; 18 11,5; 19 11,7; 20 11,9

### Placement (x,y rotation side)
3.3V  111.51,41.91 270 top
4.4V  111.51,37.34 270 top
BAT  109.99,11.43 180 top
BT1  58.17,4.06 180 top
C1  74.68,63.75 270 top
C2  64.52,16 180 top
C3  4.4,33.71 270 top
C4  65.2,18.47 270 top
C5  50.04,85.22 270 top
C6  111.26,61.98 270 top
C7  51.82,85.22 270 top
C8  95,49.78 0 top
C9  25.91,36.07 0 top
C10  14.48,36.07 0 top
C11  87.38,12.32 90 top
C12  85.09,12.32 90 top
C13  75.44,12.32 90 top
C14  73.16,12.32 90 top
C15  77.09,18.03 0 top
C16  24.9,13.59 90 top
C17  22.61,13.59 90 top
C18  12.96,13.59 90 top
C19  10.67,13.59 90 top
C20  14.61,19.56 0 top
C21  117.1,22.1 180 top
C23  101.73,11.68 180 top
C24  107.45,16.38 90 top
C25  100.08,16.89 90 top
F1  94.49,15.49 180 top
GPS  111.51,39.62 270 top
GSM  111.51,35.05 270 top
J1  46.74,-0.25 0 top
JP1  93.22,10.41 270 top
JP2  28.32,1.78 270 top
JP3  72.39,48.51 180 top
JP4  21.59,43.18 270 top
JP5  72.9,30.23 0 top
JP10  92.97,20.07 90 top
L1  80.27,6.6 180 top
L3  17.78,7.87 180 top
LED4  103.64,20.32 90 top
LED5  102.11,20.32 90 top
LED_EN  117.86,40.39 0 top
Q1  48.52,16.26 270 top
Q2  64.19,51.05 0 top
Q3  33.53,19.05 90 top
Q6  49.03,11.18 270 top
Q7  113.03,20.83 270 top
R1  58.17,16.51 180 top
R2  52.33,13.21 270 top
R3  104.91,41.91 180 top
R4  104.91,39.62 180 top
R5  104.91,37.34 180 top
R6  75.44,16.51 180 top
R7  78.74,16.51 180 top
R8  74.55,18.92 270 top
R9  12.96,17.78 180 top
R10  16.26,17.78 180 top
R11  12.07,20.19 270 top
R12  100.46,3.56 0 top
R13  102.37,7.87 0 top
R14  99.32,13.72 0 top
R15  102.37,6.35 0 top
R16  98.56,19.56 0 top
R17  98.56,21.34 0 top
R18  61.98,50.29 90 top
R19  63.5,47.62 180 top
R20  32.77,17.53 180 top
R21  36.07,15.49 270 top
R22  111.26,17.02 0 top
R23  117.1,52.83 90 top
R24  117.1,20.07 0 top
R25  117.1,16.76 180 top
R26  117.1,56.39 90 top
R27  104.91,35.05 180 top
R28  73.92,26.42 180 top
SOLAR  93.22,3.56 0 top
TP1  99.57,10.16 0 top
TP3  70.87,2.54 0 top
TP6  11.94,1.27 0 top
U1  114.3,54.36 0 top
U2  4.32,44.48 0 top
U3  80.27,12.95 90 top
U4  0.51,0 0 top
U5  119.13,45.72 90 top
U6  17.78,14.22 90 top
U7  58.17,23.11 180 top
U8  103.89,15.49 180 top
U$1  97.54,43.18 180 top
U$2  5.01,86.39 0 top
XB1  58.17,77.72 0 top

### Tracks (layer width: path | path; a pad name or v marks a point on that pad's centre or on a via)
3.3V  (via drill 0.3, 0.41, 0.41 pad 0.41)
  Top 0.254: 74.59,18.03 R8.2 | R18.1 61.47,48.93 61.47,46.99 61.98,46.48 65.54,46.48 65.54,46.23 | R3.2 v102.11,41.91
  Top 0.305: 74.59,18.03 R6.2 v72.65,16.51 | 72.92,11.68 C14.1 | v29.98,6.86 29.59,6.48 JP2.2 | TP3.P$1 70.23,3.17
  Top 0.406: v69.85,2.79 70.23,3.17 71.63,4.57 v71.63,11.68 | Q3.P$2 35.01,20.4 34.55,19.94 34.55,17.53 | 34.55,17.53 34.55,7.75 v35.06,7.24 | R20.1 34.55,17.53
  Top 0.508: U7.2 65.28,19.94 | 65.28,19.94 65.54,19.94 | C4.1 65.2,19.86 65.28,19.94 | C2.1 66.55,16
  Top 0.61: Q2.P$2 65.54,46.23 v65.54,45.47 65.54,30.73 v65.54,30.23 65.54,19.94
  Top 0.762: 72.92,11.68 v71.63,11.68 67.82,11.68 66.55,12.95 66.55,16 66.55,16.26 | J1.27 66.55,16.26 | 66.55,16.26 66.55,18.92 65.54,19.94
  Bottom 0.254: JP3.2 72.39,45.47 | v102.11,41.91 101.86,42.16 91.82,42.16
  Bottom 0.305: v72.65,16.51 72.14,16 72.14,12.19 v71.63,11.68 | U$1.3V3 91.82,42.16 91.82,44.07 90.43,45.47 72.39,45.47 v65.54,45.47 | v35.06,7.24 30.36,7.24 v29.98,6.86 | JP5.2 72.39,31.5 71.12,30.23 v65.54,30.23
  Bottom 0.406: v69.85,2.79 69.35,2.29 48.14,2.29 47.25,3.17 47.25,5.46 45.85,6.86 v43.95,6.86 35.44,6.86 v35.06,7.24
  pour Top (isolate 0.127, no thermals): 75.7,3.3 75.19,2.79 71.76,2.79 70.62,3.94 70.62,11.56 71.12,12.06 79.25,12.06 79.38,11.94 79.38,11.18 79,10.79 76.71,10.79 75.7,9.78
3V3_EN  (via drill 0.3)
  Top 0.254: U3.7 U3.6 81.28,14.4 v81.28,17.02 | v53.34,12.45 52.42,12.45 R2.2
  Top 0.305: Q1.1 48.52,13.46 50.13,11.85 Q6.C 51.15,11.18 R2.2
  Bottom 0.254: v53.34,12.45 71.12,12.45 71.63,12.95 71.63,16.51 72.27,17.14 81.16,17.14 v81.28,17.02 83.06,15.24 91.19,15.24 91.95,14.48 JP1.1
4.4V  (via drill 0.3, 0.41)
  Top 0.254: R5.2 103.13,37.34 102.62,36.83 v102.62,35.81 | v23.37,31.5 C9.1
  Top 0.305: R11.2 12.07,17.82 R9.2 v10.16,17.78 | TP6.P$1 11.94,12.7 12.2,12.7 12.2,12.71 C18.1
  Top 0.508: 4.4,35.56 4.58,35.56
  Top 0.762: C19.1 v8.89,12.71 8.75,12.71 6.48,14.99 6.48,35.56 | U4.2 4.58,35.56 6.48,35.56 | U2.1 6.48,38.35 | 6.48,38.35 6.48,35.56 | C3.1 4.4,35.56 | C9.1 21.09,38.35 11.94,38.35 | 11.94,38.35 6.48,38.35 | C10.1 11.94,38.35
  Bottom 0.254: v102.62,35.81 102.11,35.31 67.31,35.31 66.81,34.8 66.81,33.27 66.3,32.77 47.25,32.77 46.49,32 46.49,31.37 46.1,30.99 v43.56,30.99 43.31,30.99 43.06,30.73 34.8,30.73 34.55,30.99 23.88,30.99 v23.37,31.5
  Bottom 0.305: v10.16,17.78 9.66,17.27 9.66,13.48 v8.89,12.71
  pour Top (isolate 0.127, no thermals): 13.21,4.57 12.7,4.06 9.27,4.06 8.13,5.21 8.13,12.83 8.64,13.34 16.77,13.34 16.89,13.21 16.89,12.45 16.51,12.06 14.23,12.06 13.21,11.05
ADMIN
  Top 0.305: R28.2 72.9,26.84 JP5.1 J1.22
BATV_EN  (via drill 0.3)
  Top 0.305: J1.23 v70.11,24.64 | Q7.P$1 111.13,23.74 v110.75,24.13
  Bottom 0.305: v70.11,24.64 110.24,24.64 v110.75,24.13
BATV_IN  (via drill 0.51)
  Top 0.508: R25.1 R24.2 C21.1 117.95,24.04 v117.61,24.38
  Bottom 0.508: J1.24 69.73,25.27 116.72,25.27 v117.61,24.38
COMMS_EN  (via drill 0.3, 0.41)
  Top 0.254: U6.7 U6.6 18.78,17 v19.31,17.53 | 35.56,19.45 Q3.P$1
  Top 0.305: v36.58,41.15 36.58,19.94 36.09,19.45 35.56,19.45 v35.56,17.53 36.07,17.02 R21.1 35.91,16.34 35.18,15.62 35.18,8.76 35.31,8.64 v35.31,8.26 | v29.98,7.75 28.71,6.48 28.71,4.06 27.05,2.41 JP2.1
  Bottom 0.305: v36.58,41.15 37.34,41.91 v44.07,41.91 45.6,41.91 46.1,41.4 46.1,35.94 J1.8 | v19.31,17.53 v35.56,17.53 | v29.98,7.75 30.23,8 35.06,8 v35.31,8.26
COMMS_RX  (via drill 0.3)
  Top 0.305: U2.10 29.98,45.24 29.98,43.43 v30.86,42.55
  Bottom 0.305: U4.5 3.05,44.45 27.94,44.45 29.21,45.72 U2.10 | v30.86,42.55 v43.69,42.55 46.1,42.55 46.74,41.91 46.74,40.89 47.25,40.39 49.03,40.39 49.28,40.64 65.54,40.64 66.3,39.88 66.3,37.34 67.06,36.58 J1.19
COMMS_TX  (via drill 0.3)
  Top 0.305: 28.83,43.81 v29.09,43.81 27.56,43.81 26.67,44.7 26.67,45.97
  Top 0.61: U2.9 26.67,45.97
  Bottom 0.305: U4.7 25.15,48.26 26.17,47.24 U2.9 | J1.4 47.63,43.81 v43.69,43.81 v29.09,43.81
GND  (via drill 0.3, 0.41 pad 0.71, 0.51 pad 0.71)
  Top 0.254: U3.3 U3.11 | U3.9 79.77,16.34 R7.1 | U8.14 103.64,13.08 103.64,12.83 103.64,10.16 | U6.3 U6.11 | U6.9 17.28,17.61 R10.1
  Top 0.305: U8.6 104.14,15.74 U8.19 | U8.14 103.64,15.24 U8.19 | U8.8 103.14,16.37 103.25,16.26 103.25,16.13 U8.19 | U8.4 104.64,16.24 U8.19
  other vias: 79.63,15.62 8.89,24.13 26.67,24.13 8.89,13.97 8.89,18.54 26.67,18.54 26.67,13.97 21.59,24.13 13.97,24.13 17.78,24.13 17.78,14.22 15.24,13.97 20.83,13.97 21.59,18.54 21.59,16.51 26.67,16.51 26.67,21.59 8.89,21.59 7.62,3.81 27.44,4.32 29.21,11.43 29.21,13.97 31.75,13.97 31.75,5.08 29.21,19.05 29.21,16.51 27.94,25.4 7.62,25.4 33.02,32.26 45.09,31.75 44.58,41.15 46.49,48.01 45.09,29.21 35.56,41.27 36.83,45.72 37.47,31.75 37.47,29.21 35.31,29.21 35.31,31.75 48.64,85.34 53.34,80.01 49.53,35.18 49.53,27.56 49.53,25.02 49.56,42.85 49.53,45.34 50.55,51.69 2.54,82.55 12.7,82.55 22.86,82.55 33.02,82.55 33.02,72.39 22.86,72.39 12.7,72.39 2.54,72.39 2.54,62.23 12.7,62.23 22.86,62.23 33.02,62.23 22.86,52.07 12.7,52.07 12.7,29.21 22.86,29.21 33.02,29.21 2.54,29.21 2.54,19.05 31.75,19.05 2.54,6.35 7.62,1.27 22.86,1.27 15.24,1.27 60.96,82.55 73.66,82.55 83.82,82.55 93.98,82.55 114.3,82.55 83.82,72.39 93.98,72.39 104.14,72.39 104.14,82.55 104.14,62.23 93.98,62.23 83.82,62.23 104.14,52.07 93.98,52.07 83.82,52.07 114.3,72.39 112.53,58.67 112.78,48.51 83.82,44.45 73.66,52.07 73.66,44.45 93.98,44.45 104.14,44.45 114.3,44.45 73.66,40.64 73.66,36.83 83.82,31.75 93.98,32.51 103.89,31.75 118.88,25.4 94.24,37.85 101.6,39.37 71.63,26.42 83.82,26.67 91.44,26.67 104.14,26.67 91.44,22.86 104.14,22.86 114.3,22.86 114.3,15.24 114.3,5.08 106.68,5.08 91.44,7.62 88.9,1.27 60.96,72.39 60.96,62.23 60.96,41.91 53.34,62.23 53.34,52.07 53.34,41.91 59.69,52.07 60.96,30.48 53.34,30.48 76.2,26.42 60.96,15.24 60.96,10.16 55.88,10.16 58.42,25.4 58.42,20.32 48.26,20.32 50.8,12.7 48.26,7.62 53.34,5.08 63.5,5.08 66.04,10.16 68.58,7.62 96.52,11.43 99.06,11.43 99.06,1.27 102.87,9.4 104.27,15.11 104.27,15.88 103.51,15.88 103.51,15.11 16.77,14.22 18.8,14.22 100.84,19.3 98.81,18.54 63.38,50.55 63.38,49.53 66.68,47.75 65.03,54.61 67.82,54.61 66.55,41.91 64.52,33.53 66.55,31.24 64.01,17.53 69.85,13.21 69.85,10.41 71.25,22.99 89.28,22.99 70.23,23.75 71.25,17.14 71.25,20.32 89.28,20.32 89.44,16.03 89.28,12.93 90.81,14.35 90.81,16.13 92.84,13.21 97.41,17.78 80.39,22.99 75.57,22.99 85.06,20.47 80.27,12.95 81.28,12.95 79.25,12.95 73.16,14.73 75.44,14.73 83.67,14.22 88.65,14.38 12.96,15.75 10.67,15.75 22.61,15.75 24.9,15.75 17.78,21.59 80.39,20.45 84.23,16.36 87.25,16.44 78.11,15.11 60.96,13.21 43.95,85.6 43.95,84.58 43.95,78.49 43.95,79.5 43.95,80.52 43.95,81.53 43.95,83.57 43.95,82.55 43.95,67.82 43.95,66.8 43.95,58.67 43.95,59.69 43.95,60.71 43.95,61.72 43.95,62.74 43.95,63.75 43.95,64.77 43.95,65.79 43.95,47.75 43.95,46.74 43.95,45.72 43.95,21.59 43.95,22.61 43.95,23.62 43.95,24.64 43.95,25.65 43.95,26.67 43.95,27.69 43.95,28.7 43.95,29.72 43.95,10.92 43.95,9.91 43.95,8.89 43.95,7.87 43.95,3.81 43.95,4.83 45.85,57.02 45.34,72.77 45.85,87.76 45.72,1.02 58.17,4.06 45.72,16 50.3,9.65 48.9,11.18 112.02,55.63 112.02,53.09 118.37,51.05 43.95,44.7 70.36,27.69 70.36,31.5
  pour Top (isolate 0.152, no thermals): 89.41,12.34 71.12,12.34 70.62,12.83 70.62,23.11 71.12,23.62 89.41,23.62 89.92,23.11 89.92,12.83
  pour Top (isolate 0.127, no thermals): 26.93,13.59 8.64,13.59 8.13,14.1 8.13,24.38 8.64,24.89 26.93,24.89 27.44,24.38 27.44,14.1
  pour Top (isolate 0.152, rank 2): -11.68,97.79 -11.68,-9.65 130.31,-9.65 130.31,97.79
  pour Bottom (isolate 0.152, rank 2): -10.66,96.77 -10.66,-10.67 131.32,-10.67 131.32,96.77
  pour Top (no thermals): 20.58,42.9 22.61,42.9 22.61,41.78 20.58,41.78
GPS_EN  (via drill 0.3)
  Top 0.254: v65.03,50.04 64.59,49.6 Q2.P$1 64.59,47.86 R19.1
  Bottom 0.254: v65.03,50.04 66.55,50.04 J1.13 71.63,51.82 72.39,51.05 JP3.1
GPS_RX2  (1 unrouted)
  Top 0.305: U5.11 73.92,69.85 72.9,68.83 72.9,54.36 70.11,51.56 70.11,49.78 69.6,49.28 J1.14
GPS_TX2  (1 unrouted)
  Top 0.305: U5.10 74.17,67.31 73.41,66.55 73.41,54.1 70.62,51.31 70.62,47.75 69.6,46.74 J1.15
GSM_KEY
  Top 0.305: U2.7 JP4.1
GSM_RST  (via drill 0.3)
  Top 0.305: v17.53,43.18 16.51,44.2 U2.5
  Bottom 0.305: J1.5 46.49,43.18 v44.07,43.18 v17.53,43.18
N$1
  Top 0.305: U1.12 117.08,55.56 R26.1 R23.2
N$2  (via drill 0.41)
  Top 0.305: v56.14,16.51 R1.2 | Q1.2 48.26,16.26 47.37,15.37 47.37,12.32 47.5,12.19 47.86,12.19 Q6.B
  Bottom 0.305: v56.14,16.51 55.88,16.26 Q1.2
N$3
  Top 0.305: GSM.C 113.8,35.05 114.3,35.56 114.3,37.34 | 114.3,37.34 114.3,39.62 | 114.3,39.62 114.3,41.91 | GPS.C 114.3,39.62 | 3.3V.C 114.3,41.91 | 114.3,41.91 117.61,41.91 LED_EN.2 | 4.4V.C 114.3,37.34
N$4
  Top 0.305: R4.1 GPS.A
N$5
  Top 0.254: 77.89,18.01 C15.2 | U3.10 79.27,15.14 R7.2
  Top 0.305: 77.89,18.01 R7.2 R6.1
N$6  (via drill 3.31)
  other vias: 33.53,86.37
N$9
  Top 0.254: R8.1 74.58,19.77
  Top 0.305: 74.58,19.77 C15.1
N$10
  Top 0.254: U3.4 80.77,8.65 L1.1
  pour Top (isolate 0.127, no thermals): 80.9,11.94 80.9,11.05 81.41,10.54 83.7,10.54 84.33,9.91 84.33,2.92 80.9,2.92 80.65,3.17 80.65,11.94
N$11
  Top 0.254: U3.2 79.77,8.65 L1.2
  pour Top (isolate 0.127, no thermals): 79.63,11.94 79.63,11.05 79.12,10.54 76.84,10.54 76.2,9.91 76.2,2.92 79.63,2.92 79.89,3.17 79.89,11.94
N$12
  Top 0.305: R22.2 112.11,17.56 Q7.P$3 111.15,18.54 111.89,18.54 112.27,18.92 112.27,20.07 112.63,20.43 Q7.P$6
N$13
  Top 0.305: R3.1 3.3V.A
N$14
  Top 0.305: R27.1 GSM.A
N$15
  Top 0.305: R5.1 4.4V.A
N$17
  Top 0.254: U6.10 16.78,16.41 R10.2
  Top 0.305: R9.1 R10.2 15.41,19.53 C20.2
N$18
  Top 0.305: C20.1 13.55,19.56 R11.1
N$19
  Top 0.254: U6.4 18.28,9.92 L3.1
  pour Top (no thermals): 18.39,13.21 18.39,12.32 18.9,11.81 21.21,11.81 21.85,11.18 21.85,4.19 18.42,4.19 18.16,4.45 18.16,13.21
N$20
  Top 0.254: L3.2 17.28,9.92 U6.2
  pour Top (no thermals): 17.15,13.21 17.15,12.32 16.64,11.81 14.35,11.81 13.72,11.18 13.72,4.19 17.15,4.19 17.4,4.45 17.4,13.21
N$21
  Top 0.254: R12.2 101.73,4.19 102.37,4.83 104.65,4.83 105.16,5.33 105.16,14.48 105.43,14.74 U8.1
N$22
  Top 0.254: U8.15 104.14,13.34 104.14,12.83 104.14,8.13 103.89,7.87 R13.2
N$23
  Top 0.254: U8.12 101.87,14.74 101.6,14.48 101.6,13.97 101.35,13.72 R14.2
N$24
  Top 0.254: R15.2 104.14,6.35 104.65,6.86 104.65,13.21 104.64,13.47 U8.16
N$25
  Top 0.254: U8.7 LED4.C
N$27
  Top 0.254: LED5.C 101.6,18.76 101.6,16.51 101.87,16.24 U8.9
N$28
  Top 0.254: R16.1 R17.1 93.48,21.34 92.97,20.83 92.97,20.57
N$29
  Top 0.254: LED4.A 103.64,20.57 103.38,20.32 100.17,20.32 R16.2
N$30
  Top 0.254: LED5.A 99.44,21.37 R17.2
N$31  (via drill 0.3)
  Top 0.254: U8.10 U8.11 102.11,15.49 | C25.1 100.08,15.49 | 92.97,19.56 92.97,19.05 93.48,18.54 97.79,18.54 98.3,18.03 98.3,15.49 | U8.5 104.64,17.79 v104.4,18.03
  Top 0.775: 102.11,15.49 v101.35,15.49 100.08,15.49 98.3,15.49 F1.1
  Bottom 0.254: v104.4,18.03 102.11,18.03 101.35,17.27 v101.35,15.49
N$33
  cutout Top: 80.39,15.88 72.39,15.88 72.14,16.13 72.14,16.89 72.39,17.14 73.41,17.14 73.66,17.4 73.66,20.32 73.92,20.57 77.73,20.57 80.39,17.91
  cutout Top: 17.91,17.14 9.91,17.14 9.66,17.4 9.66,18.16 9.91,18.41 10.93,18.41 11.18,18.67 11.18,21.59 11.43,21.84 15.24,21.84 17.91,19.18
N$34
  Top 0.254: Q2.P$3 66.49,50.23 66.17,50.55 64.77,50.55 64.59,50.73 Q2.P$6 62.19,51.35 R18.2
N$35
  Top 0.254: Q3.P$6 33.55,19.45 34.04,19.94 34.04,20.83 34.56,21.35 Q3.P$3
  Top 0.406: Q3.P$6 33.23,19 31.92,17.69 R20.2
RADIO_RX  (via drill 0.3)
  Top 0.305: v51.44,37.34 51.44,81.79 50.5,82.72 XB1.3
  Bottom 0.305: J1.7 50.68,36.58 v51.44,37.34
RADIO_TX  (via drill 0.3)
  Top 0.305: v52.07,39.62 52.07,82.04 50.8,83.31 48.58,83.31 XB1.2
  Bottom 0.305: J1.6 51.57,39.12 v52.07,39.62
RTC_!INT
  Top 0.305: U7.3 62.11,21.21 61.22,20.32 61.22,17.27 60.46,16.51 R1.1
RTC_BAT  (1 unrouted)
  Top 0.305: Q1.3 46.74,15.75 46.74,11.18 47.69,10.23 Q6.E 48.21,10.23 50.3,8.13
  Top 0.508: U7.14 54.49,21.21 55.12,20.57 55.12,12.95 50.3,8.13 BT1.3
SCL  (via drill 0.3)  (1 unrouted)
  Top 0.305: U7.16 51.69,18.67 50.3,20.07 50.3,46.99 J1.2 | U5.22 114.81,67.31 113.92,66.42 v113.92,57.66 114.3,57.28 U1.14
  Bottom 0.305: J1.2 49.53,50.8 49.53,56.26 50.3,57.02 113.54,57.28 v113.92,57.66
SD_CS  (via drill 0.3)
  Top 0.305: v78.11,38.48 79.12,39.5 U$1.CS | J1.20 69.5,34.04 69.93,34.47 69.93,38 v70.41,38.48
  Bottom 0.305: v70.41,38.48 v78.11,38.48
SD_MISO
  Bottom 0.305: J1.16 69.35,43.18 81.66,43.18 U$1.MISO
SD_MOSI
  Bottom 0.305: J1.17 69.35,42.67 81.03,42.67 81.66,42.04 U$1.MOSI
SD_SCK
  Bottom 0.305: J1.18 85.35,39.12 86.74,40.51 U$1.SCK
SDA  (via drill 0.3)  (1 unrouted)
  Top 0.305: U7.15 51.44,19.94 50.8,20.57 50.8,49.02 J1.1 | U5.23 115.07,64.77 114.56,64.26 v114.56,59.31 115.31,58.55 U1.13
  Bottom 0.305: v114.56,59.31 113.16,57.91 50.04,57.66 48.9,56.52 48.9,52.7 J1.1
V_BATT
  Top 0.254: U8.2 U8.3 105.67,15.49 | C24.1 107.45,15.49
  Top 0.508: 111.08,15.57 110.49,15.49 | Q7.P$2 110.16,19.48 109.73,19.05 109.73,17.02 | 109.73,17.02 109.73,15.49 | R22.1 109.73,17.02
  Top 0.775: 108.72,15.49 109.73,15.49 110.49,15.49 112.49,13.5 BAT.+
  Top 0.8: 108.72,15.49 107.45,15.49 105.67,15.49
V_COMMS_IO  (via drill 0.3)
  Top 0.254: R27.2 102.87,35.05 v102.62,34.8
  Top 0.406: Q3.P$4 33.67,21.35 34.29,21.97 v34.29,30.23 U2.12
  Bottom 0.254: v102.62,34.8 70.36,34.8 69.85,34.29 69.85,33.27 69.35,32.77 67.31,32.77 66.81,32.26 50.04,32.26 49.53,31.75 49.53,30.73 49.03,30.23 47.5,30.23 47.25,30.48 v43.95,30.48 43.56,30.48 43.31,30.23 v34.29,30.23
V_GPS  (via drill 0.3, 0.61)
  Top 0.254: 103.38,39.62 v102.87,40.13
  Top 0.305: C5.1 50.04,86.72 | C7.1 51.82,86.72 | R4.2 103.38,39.62 | C6.1 111.27,62.74 112.78,62.74 113.29,62.22 U1.1 111.48,56.36 111.26,56.13 111.26,52.58 111.48,52.36 U1.6 | R26.2 116.46,57.87 116.46,60.83 U5.24
  Top 0.508: C1.1 74.92,64.77 U5.9
  Top 0.61: XB1.1 50.04,86.72 51.82,86.72 52.73,86.72 53.34,86.11 53.34,82.04 54.11,81.28 65.47,81.28 66.49,80.26 v66.49,64.77 Q2.P$4 | U5.9 78.49,64.77 79,64.26 79,52.58 v82.3,49.28 | C8.1 93.73,49.78 92.46,48.51 U5.3 | C6.1 v111.26,64.77
  Bottom 0.254: v102.87,40.13 102.87,41.91 102.11,42.67 92.71,42.67 92.46,42.93 U5.3
  Bottom 0.61: v66.49,64.77 U5.9 v111.26,64.77 115.32,64.77 U5.24 | v82.3,49.28 91.7,49.28 92.46,48.51 U5.3
V_SYS  (via drill 0.3, 0.76)
  Top 0.254: U3.8 v80.27,15.24 | U6.8 v17.78,16.51 | v20.07,12.7 20.32,12.7 | 92.54,14.69 94.49,12.74 JP1.2
  Top 0.762: 33.28,7.62 33.28,7.37 v34.67,5.97
  Top 0.775: C16.1 31.49,12.71 33.28,10.92 33.28,7.62 | v68.84,1.27 69.35,0.76 84.84,0.76 85.86,1.78 85.86,11.44 | F1.2 92.54,14.69 89.3,11.44 C11.1 85.86,11.44 | 85.86,11.44 C12.1 v82.55,11.43 81.79,11.43
  Bottom 0.254: v80.27,15.24 80.52,15.49 82.05,15.49 82.55,14.99 v82.55,11.43 | v17.78,16.51 18.04,16.76 19.56,16.76 20.07,16.26 v20.07,12.7
  Bottom 0.762: 47.76,1.27 46.23,2.79 46.23,4.83 45.09,5.97 v34.67,5.97
  Bottom 0.775: 47.76,1.27 v68.84,1.27
  pour Top (isolate 0.152, no thermals): 84.84,3.3 85.35,2.79 88.78,2.79 89.92,3.94 89.92,11.56 89.41,12.04 81.28,12.04 81.18,11.94 81.18,11.18 81.54,10.82 83.85,10.82 84.86,9.78
  pour Top (isolate 0.127, no thermals): 22.36,4.57 22.86,4.06 26.29,4.06 27.44,5.21 27.44,12.83 26.93,13.34 18.8,13.34 18.67,13.21 18.67,12.45 19.05,12.06 21.34,12.06 22.36,11.05
VCC_HP2_SW1
  Top 0.508: Q7.P$4 114.48,18.53 R25.2
VIN
  Top 0.254: U8.13 103.14,13.72 103.1,13.72
  Top 0.305: TP1.P$1 99.57,9.4
  Top 0.406: SOLAR.2 94.49,7.37 96.52,9.4 99.57,9.4 100.71,9.4 102.61,11.29 C23.1 103.1,12.46 103.1,13.72 103.1,14.1

### Text on the board
tPlace: GSM | SWARM | RADIO | GPS | MCU | ADMIN | RTC | 4.4V | 3.3V
bPlace: Misc: / RTC / 3V3_EN / BATVOLTS_EN / BATVOLTS_DIV | Headers: / THING+ / XTSD / GPS / RADIO / GSM / SWARM | Power: / BAT CHG / 3V3 / V_GPS / 4V4 / V_GSMIO | Graeme Bragg / Kirk Martinez / Sherif Attia / ECS / University of / Southampton
tNames: IT3 | V1.0 | + | +
Document: GND | V_IN | GND | V_BATT | 5V | GND | GND | GND | GND | GND | VCC_2 | VCC_1 | 3.3V | V_GSM
tDocu: !PGD | !CHG